# EAGLE design smartstand-usb-dac-i2s-rev-b (EAGLE 7.3.0)

## Sheet 1 of 5
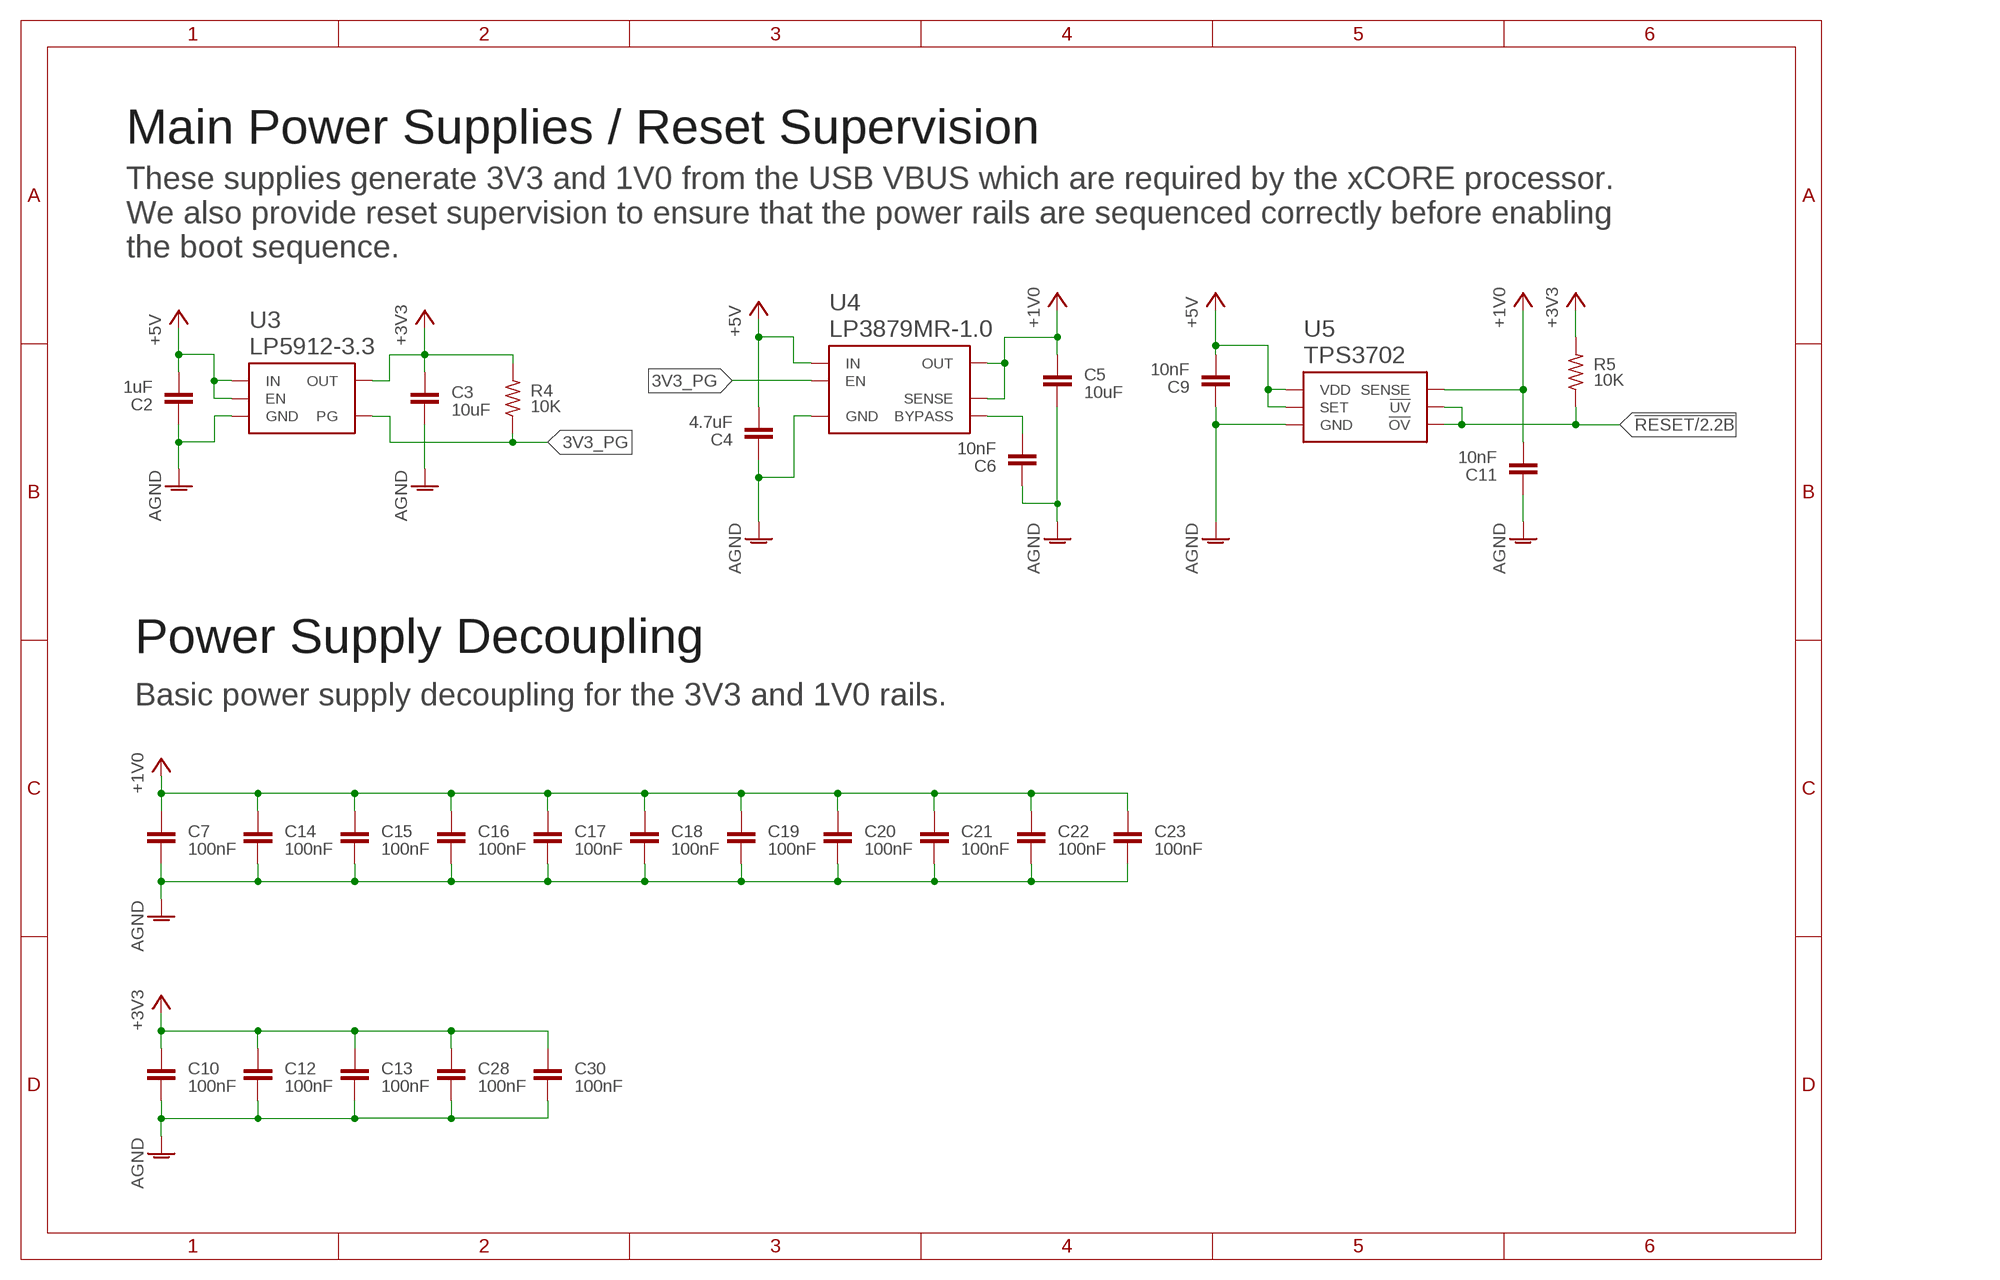
[diagram p0: schematic, sheet 1]

### Parts
C2  1uF  C-EUC0603  [C0603]
C3  10uF  C-EUC0603  [C0603]
C4  4.7uF  C-EUC0603  [C0603]
C5  10uF  C-EUC0603  [C0603]
C6  10nF  C-EUC0402  [C0402]
C7  100nF  C-EUC0402  [C0402]
C9  10nF  C-EUC0402  [C0402]
C10  100nF  C-EUC0402  [C0402]
C11  10nF  C-EUC0402  [C0402]
C12  100nF  C-EUC0402  [C0402]
C13  100nF  C-EUC0402  [C0402]
C14  100nF  C-EUC0402  [C0402]
C15  100nF  C-EUC0402  [C0402]
C16  100nF  C-EUC0402  [C0402]
C17  100nF  C-EUC0402  [C0402]
C18  100nF  C-EUC0402  [C0402]
C19  100nF  C-EUC0402  [C0402]
C20  100nF  C-EUC0402  [C0402]
C21  100nF  C-EUC0402  [C0402]
C22  100nF  C-EUC0402  [C0402]
C23  100nF  C-EUC0402  [C0402]
C28  100nF  C-EUC0402  [C0402]
C30  100nF  C-EUC0402  [C0402]
R4  10K  R-US-VERTICALR0402  [R0402]
R5  10K  R-US-VERTICALR0402  [R0402]
U3  LP5912-3.3  LP5912-3.3DRV  [P-PWSON-N6]
U4  LP3879MR-1.0  [PSOP-8-POWERPAD-DDA]
U5  TPS3702  TPS3702CX10DDC  [R-PDSO-G6]

### Nets
3V3_PG: R4.1 U3.P$3(PG) U4.8(EN)
!RESET: R5.1 U5.1(!UV) U5.6(!OV) ; also sheet 2,5
+1V0: C5.1 C7.1 C11.2 C14.1 C15.1 C16.1 C17.1 C18.1 C19.1 C20.1 C21.1 C22.1 C23.1 U4.5(OUT) U4.6(SENSE) U5.3(SENSE) ; also sheet 2,5
+3V3: C3.1 C10.1 C12.1 C13.1 C28.1 C30.1 R4.2 R5.2 U3.P$1(OUT) ; also sheet 2,3,4,5
+5V: C2.2 C4.2 C9.2 U3.P$4(EN) U3.P$6(IN) U4.4(IN) U5.4(SET) U5.5(VDD) ; also sheet 3,4,5
AGND: C2.1 C3.2 C4.1 C5.2 C6.1 C7.2 C9.1 C10.2 C11.1 C12.2 C13.2 C14.2 C15.2 C16.2 C17.2 C18.2 C19.2 C20.2 C21.2 C22.2 C23.2 C28.2 C30.2 U3.P$5(GND) U3.P$8(GND) U3.P$9(GND) U3.P$EP(GND) U4.3(GND) U4.EP(GND) U4.P$1(GND) U4.P$2(GND) U4.P$3(GND) U4.P$4(GND) U4.P$5(GND) U4.P$6(GND) U5.2(GND) ; also sheet 2,3,4,5
N$11: C6.2 U4.1(BYPASS)

### Notes on the sheet
- Main Power Supplies / Reset Supervision
- These supplies generate 3V3 and 1V0 from the USB VBUS which are required by the xCORE processor.
  We also provide reset supervision to ensure that the power rails are sequenced correctly before enabling
  the boot sequence.
- Power Supply Decoupling
- Basic power supply decoupling for the 3V3 and 1V0 rails.

## Sheet 2 of 5
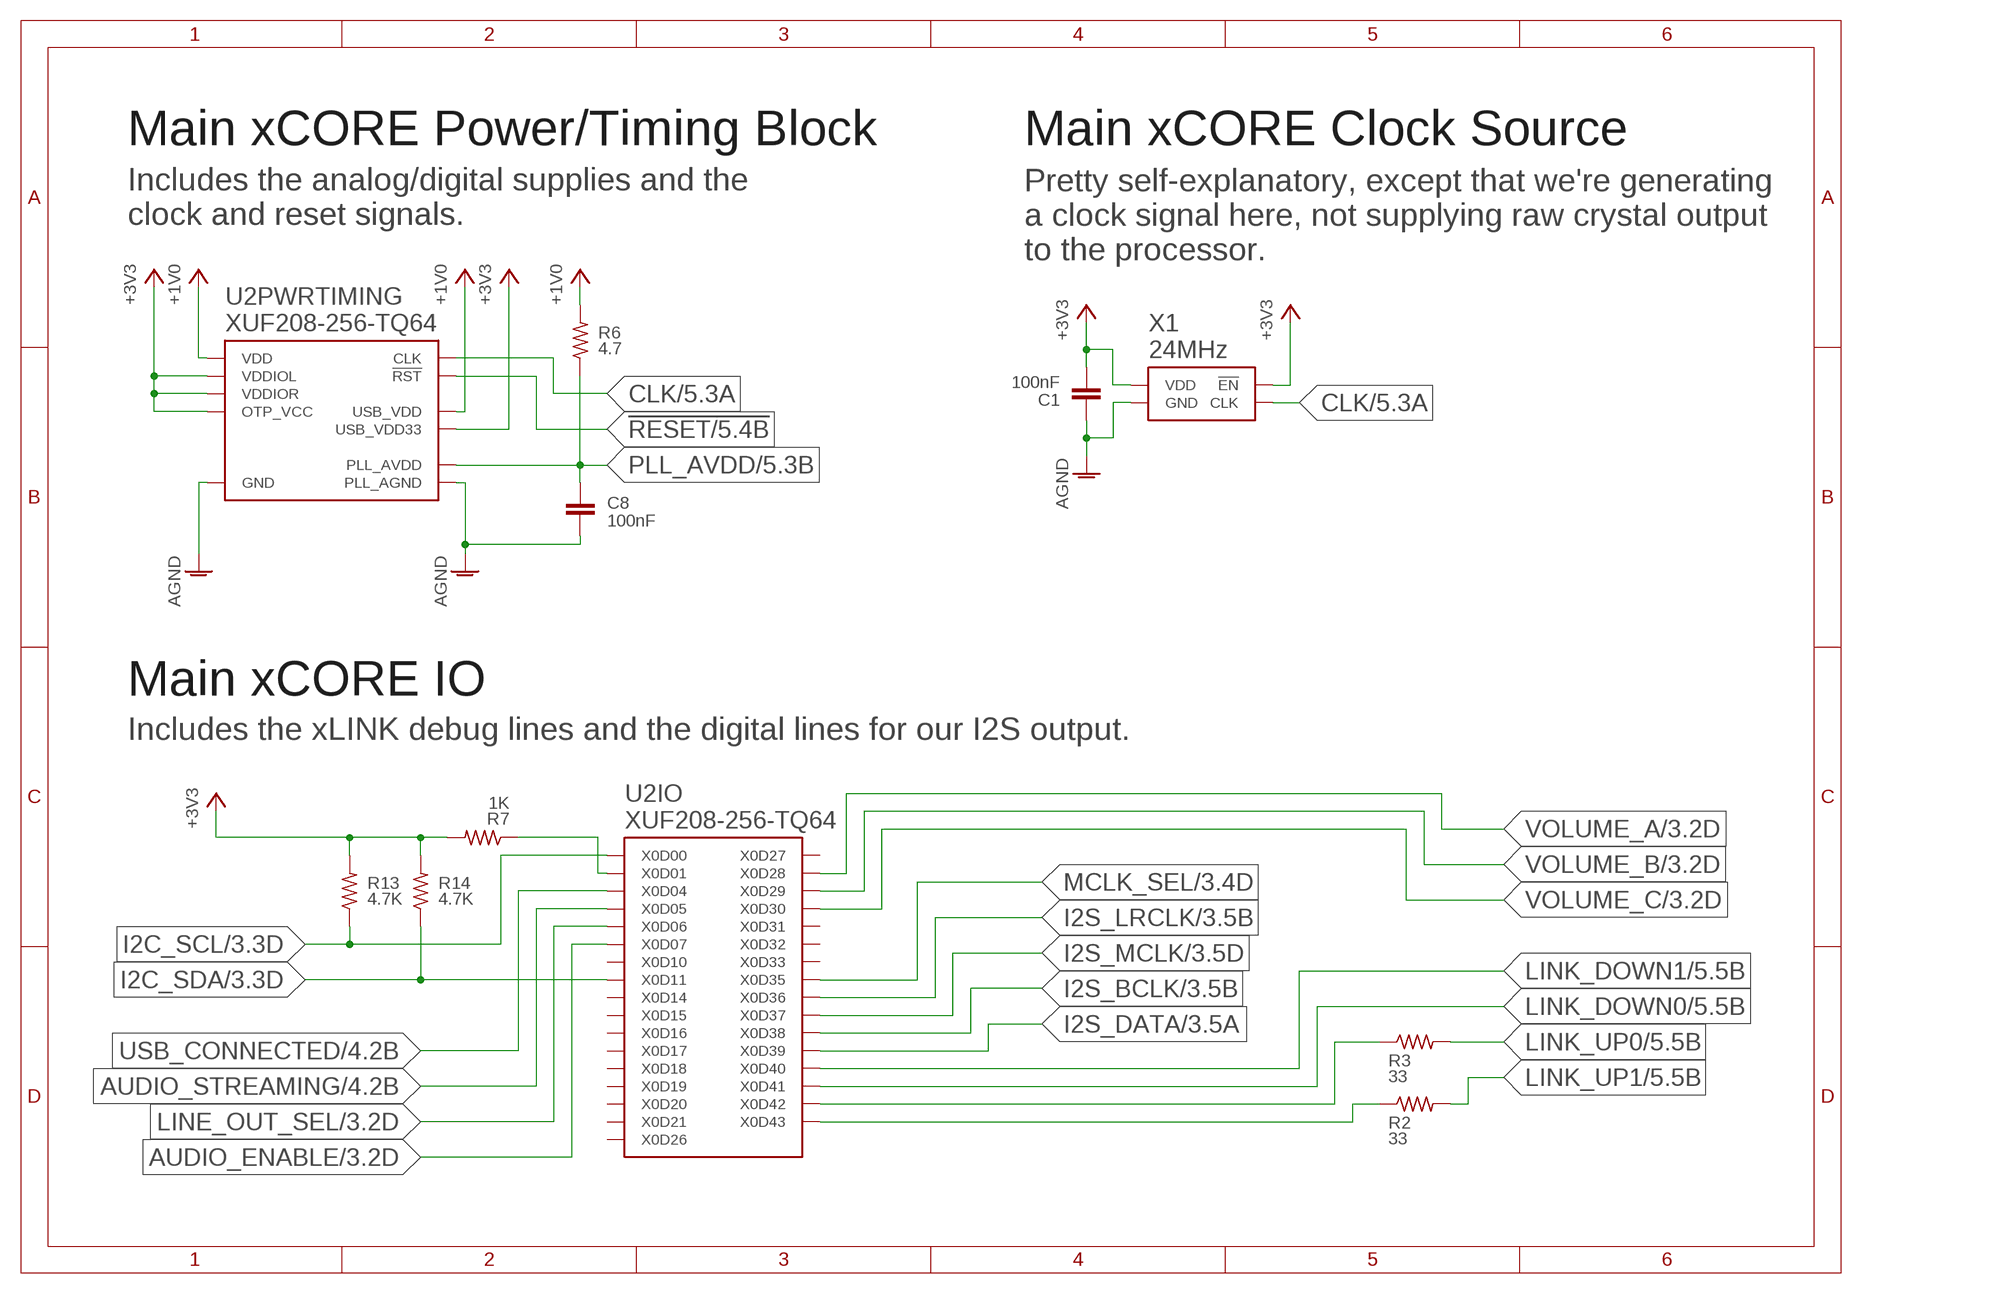
[diagram p1: schematic, sheet 2]

### Parts
C1  100nF  C-EUC0402  [C0402]
C8  100nF  C-EUC0402  [C0402]
R2  33  R-US_R0402  [R0402]
R3  33  R-US_R0402  [R0402]
R6  4.7  R-US-VERTICALR0402  [R0402]
R7  1K  R-US_R0402  [R0402]
R13  4.7K  R-US-VERTICALR0402  [R0402]
R14  4.7K  R-US-VERTICALR0402  [R0402]
U2  XUF208-256-TQ64  [TQFP-64-EXPOSED-PAD]
X1  24MHz  KC2520C  [KC2520C]

### Nets
!RESET: U2.P$57(PWRTIMING:!RST) ; also sheet 1,5
+1V0: R6.2 U2.P$9(PWRTIMING:VDD) U2.P$10(PWRTIMING:VDD) U2.P$20(PWRTIMING:VDD) U2.P$27(PWRTIMING:USB_VDD) U2.P$31(PWRTIMING:VDD) U2.P$39(PWRTIMING:VDD) U2.P$40(PWRTIMING:VDD) U2.P$41(PWRTIMING:VDD) U2.P$52(PWRTIMING:VDD) U2.P$56(PWRTIMING:VDD) U2.P$59(PWRTIMING:VDD) ; also sheet 1,5
+3V3: C1.2 R7.2 R13.2 R14.2 U2.P$3(PWRTIMING:VDDIOL) U2.P$13(PWRTIMING:VDDIOL) U2.P$22(PWRTIMING:USB_VDD33) U2.P$34(PWRTIMING:VDDIOR) U2.P$44(PWRTIMING:VDDIOR) U2.P$55(PWRTIMING:OTP_VCC) X1.P$1(!EN) X1.P$4(VDD) ; also sheet 1,3,4,5
AGND: C1.1 C8.2 U2.P$54(PWRTIMING:PLL_AGND) U2.P$65(PWRTIMING:GND) U2.P$66(PWRTIMING:GND) U2.P$67(PWRTIMING:GND) U2.P$68(PWRTIMING:GND) U2.P$69(PWRTIMING:GND) U2.P$70(PWRTIMING:GND) U2.P$71(PWRTIMING:GND) U2.P$72(PWRTIMING:GND) U2.P$73(PWRTIMING:GND) U2.P$74(PWRTIMING:GND) X1.P$2(GND) ; also sheet 1,3,4,5
AUDIO_ENABLE: U2.P$19(IO:X0D07) ; also sheet 3
AUDIO_STREAMING: U2.P$17(IO:X0D05) ; also sheet 4
CLK: U2.P$58(PWRTIMING:CLK) X1.P$3(CLK) ; also sheet 5
I2C_SCL: R13.1 U2.P$14(IO:X0D00) ; also sheet 3
I2C_SDA: R14.1 U2.P$16(IO:X0D11) ; also sheet 3
I2S_BCLK: U2.P$2(IO:X0D38) ; also sheet 3
I2S_DATA: U2.P$4(IO:X0D39) ; also sheet 3
I2S_LRCLK: U2.P$1(IO:X0D36) ; also sheet 3
I2S_MCLK: U2.P$64(IO:X0D37) ; also sheet 3
LINE_OUT_SEL: U2.P$18(IO:X0D06) ; also sheet 3,4
LINK_DOWN0: U2.P$6(IO:X0D41) ; also sheet 5
LINK_DOWN1: U2.P$5(IO:X0D40) ; also sheet 5
LINK_UP0: R3.2 ; also sheet 5
LINK_UP1: R2.2 ; also sheet 5
MCLK_SEL: U2.P$42(IO:X0D35) ; also sheet 3
N$8: R3.1 U2.P$7(IO:X0D42)
N$9: R2.1 U2.P$8(IO:X0D43)
N$10: R7.1 U2.P$11(IO:X0D01)
PLL_AVDD: C8.1 R6.1 U2.P$53(PWRTIMING:PLL_AVDD) ; also sheet 5
USB_CONNECTED: U2.P$15(IO:X0D04) ; also sheet 4
VOLUME_A: U2.P$47(IO:X0D28) ; also sheet 3
VOLUME_B: U2.P$49(IO:X0D29) ; also sheet 3
VOLUME_C: U2.P$50(IO:X0D30) ; also sheet 3
Unconnected: U2.P$12(IO:X0D10) U2.P$28(IO:X0D14) U2.P$29(IO:X0D15) U2.P$30(IO:X0D20) U2.P$32(IO:X0D21) U2.P$35(IO:X0D16) U2.P$36(IO:X0D17) U2.P$37(IO:X0D18) U2.P$38(IO:X0D19) U2.P$43(IO:X0D26) U2.P$45(IO:X0D27) U2.P$46(IO:X0D32) U2.P$48(IO:X0D33) U2.P$51(IO:X0D31)

### Notes on the sheet
- Main xCORE Power/Timing Block | Main xCORE Clock Source
- Includes the analog/digital supplies and the
  clock and reset signals.
- Pretty self-explanatory, except that we're generating
  a clock signal here, not supplying raw crystal output
  to the processor.
- Main xCORE IO
- Includes the xLINK debug lines and the digital lines for our I2S output.

## Sheet 3 of 5
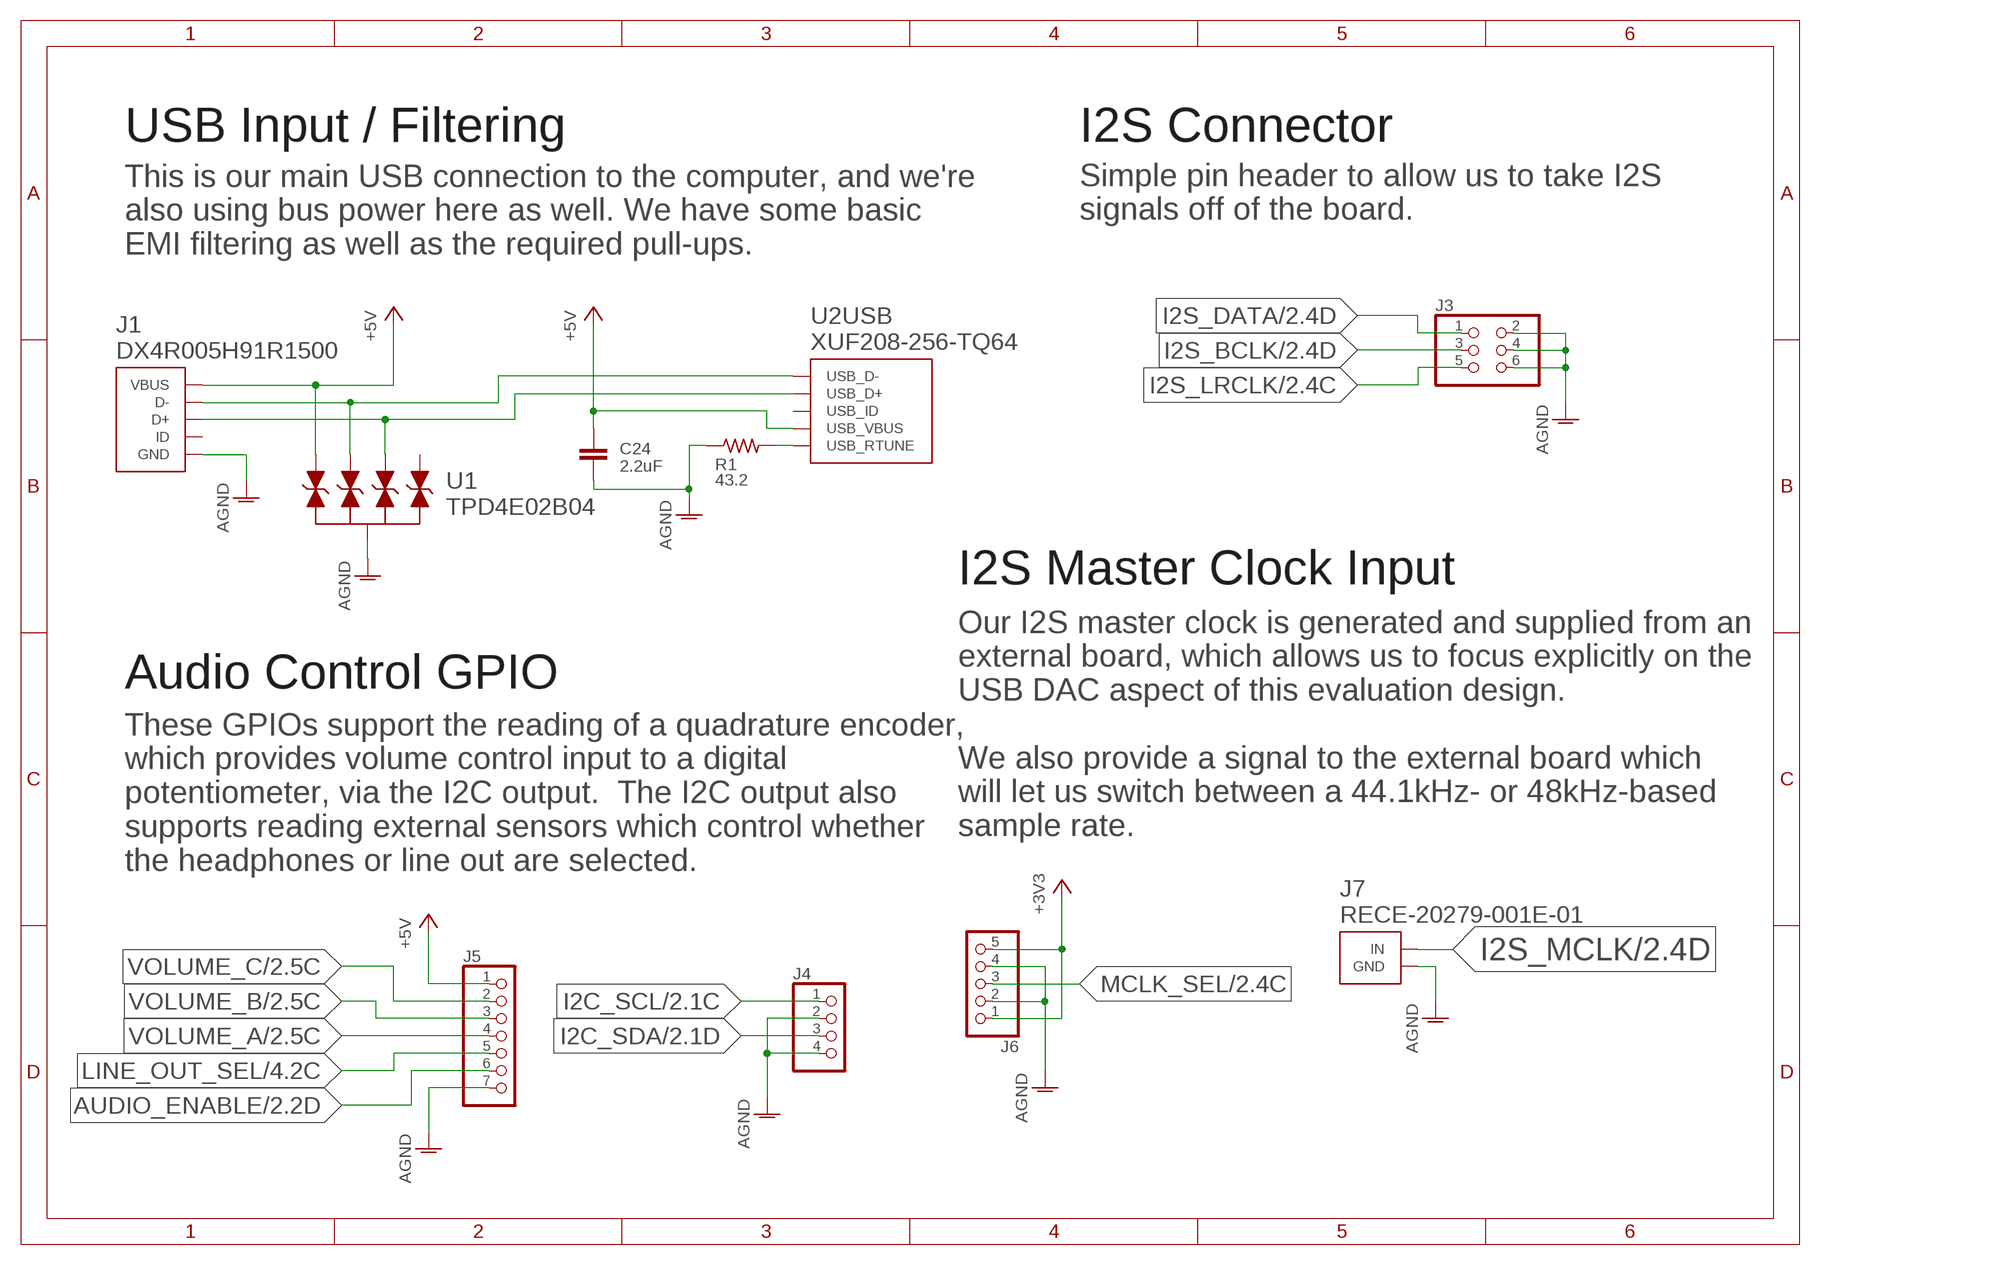
[diagram p2: schematic, sheet 3]

### Parts
C24  2.2uF  C-EUC0603  [C0603]
J1  DX4R005H91R1500  [DX4R005H91R1500]
J3  PINHD-2X3  [2X03]
J4  PINHD-1X4  [1X04]
J5  PINHD-1X7  [1X07]
J6  PINHD-1X5  [1X05]
J7  RECE-20279-001E-01  [IPEX-MHF]
R1  43.2  R-US_R0402  [R0402]
U1  TPD4E02B04  [R-PUSON-N10]

### Nets
+3V3: J6.1 J6.5 ; also sheet 1,2,4,5
+5V: C24.1 J1.P$1(VBUS) J5.1 U1.P$1(IO1) U1.P$10(IO1) U2.P$23(USB:USB_VBUS) ; also sheet 1,4,5
AGND: C24.2 J1.P$5(GND) J3.2 J3.4 J3.6 J4.2 J4.4 J5.7 J6.2 J6.4 J7.P$1(GND) J7.P$2(GND) R1.1 U1.P$3(GND) U1.P$8(GND) ; also sheet 1,2,4,5
AUDIO_ENABLE: J5.6 ; also sheet 2
I2C_SCL: J4.1 ; also sheet 2
I2C_SDA: J4.3 ; also sheet 2
I2S_BCLK: J3.3 ; also sheet 2
I2S_DATA: J3.1 ; also sheet 2
I2S_LRCLK: J3.5 ; also sheet 2
I2S_MCLK: J7.P$3(IN) ; also sheet 2
LINE_OUT_SEL: J5.5 ; also sheet 2,4
MCLK_SEL: J6.3 ; also sheet 2
N$1: R1.2 U2.P$24(USB:USB_RTUNE)
USB_D_N [USB]: J1.P$2(D-) U1.P$2(IO2) U1.P$9(IO2) U2.P$26(USB:USB_D-)
USB_D_P [USB]: J1.P$3(D+) U1.P$4(IO3) U1.P$7(IO3) U2.P$25(USB:USB_D+)
VOLUME_A: J5.4 ; also sheet 2
VOLUME_B: J5.3 ; also sheet 2
VOLUME_C: J5.2 ; also sheet 2
Unconnected: J1.P$4(ID) U1.P$5(IO4) U1.P$6(IO4) U2.P$21(USB:USB_ID)

### Notes on the sheet
- USB Input / Filtering | I2S Connector
- Simple pin header to allow us to take I2S
  signals off of the board.
- This is our main USB connection to the computer, and we're
  also using bus power here as well. We have some basic
  EMI filtering as well as the required pull-ups.
- I2S Master Clock Input
- Audio Control GPIO
- Our I2S master clock is generated and supplied from an
  external board, which allows us to focus explicitly on the
  USB DAC aspect of this evaluation design.
  
  We also provide a signal to the external board which
  will let us switch between a 44.1kHz- or 48kHz-based
  sample rate.
- These GPIOs support the reading of a quadrature encoder,
  which provides volume control input to a digital
  potentiometer, via the I2C output.  The I2C output also
  supports reading external sensors which control whether
  the headphones or line out are selected.

## Sheet 4 of 5
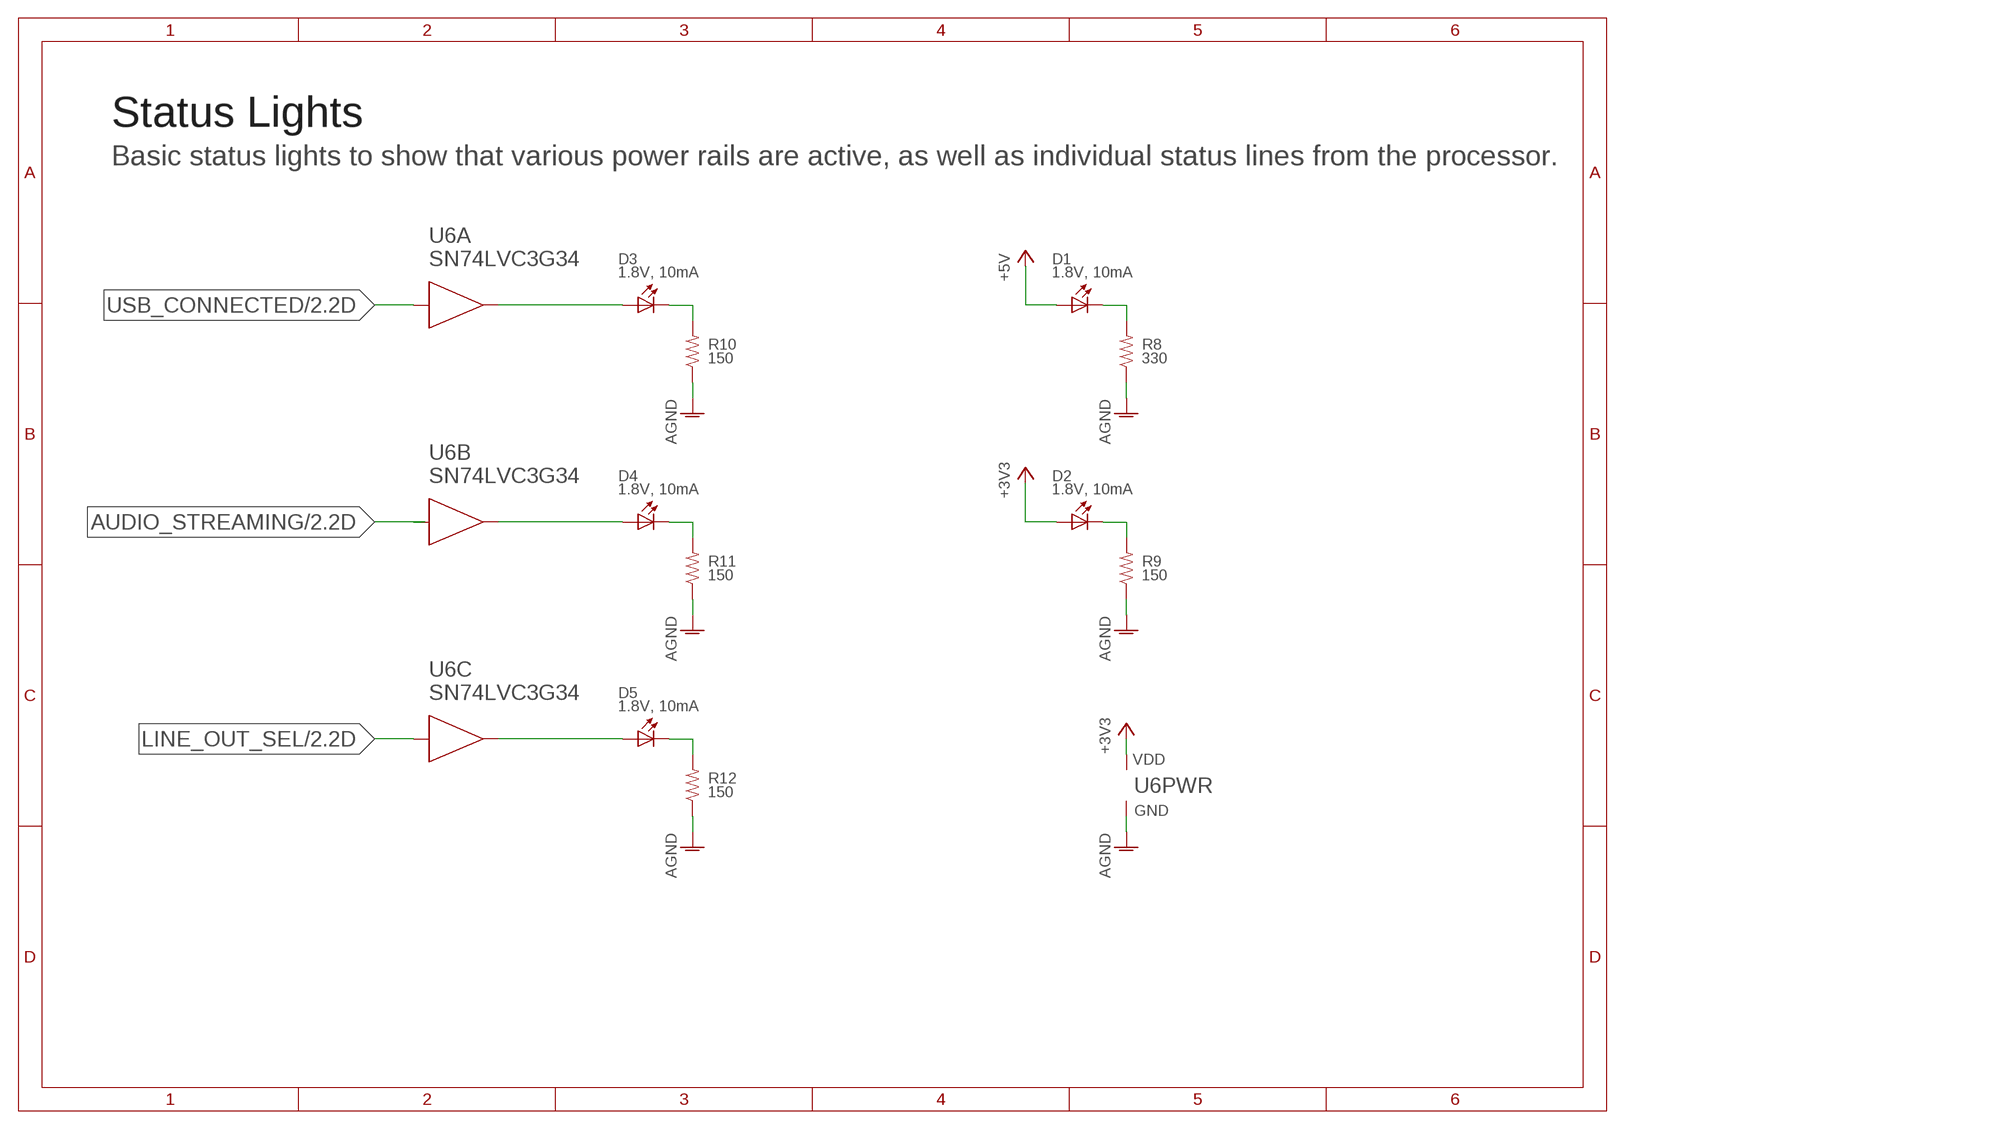
[diagram p3: schematic, sheet 4]

### Parts
D1  1.8V, 10mA  DIALIGHT-598-MICROSMD-0603  [DIALIGHT-0603]
D2  1.8V, 10mA  DIALIGHT-598-MICROSMD-0603  [DIALIGHT-0603]
D3  1.8V, 10mA  DIALIGHT-598-MICROSMD-0603  [DIALIGHT-0603]
D4  1.8V, 10mA  DIALIGHT-598-MICROSMD-0603  [DIALIGHT-0603]
D5  1.8V, 10mA  DIALIGHT-598-MICROSMD-0603  [DIALIGHT-0603]
R8  330  R-US-VERTICALR0402  [R0402]
R9  150  R-US-VERTICALR0402  [R0402]
R10  150  R-US-VERTICALR0402  [R0402]
R11  150  R-US-VERTICALR0402  [R0402]
R12  150  R-US-VERTICALR0402  [R0402]
U6  SN74LVC3G34  [R-PDSO-G8]

### Nets
+3V3: D2.1(A) U6.8(PWR:VDD) ; also sheet 1,2,3,5
+5V: D1.1(A) ; also sheet 1,3,5
AGND: R8.1 R9.1 R10.1 R11.1 R12.1 U6.4(PWR:GND) ; also sheet 1,2,3,5
AUDIO_STREAMING: U6.3(B:A) ; also sheet 2
LINE_OUT_SEL: U6.6(C:A) ; also sheet 2,3
N$6: D4.1(A) U6.5(B:Y)
N$7: D1.2(C) R8.2
N$12: D2.2(C) R9.2
N$13: D3.1(A) U6.7(A:Y)
N$14: D3.2(C) R10.2
N$15: D4.2(C) R11.2
N$16: D5.1(A) U6.2(C:Y)
N$17: D5.2(C) R12.2
USB_CONNECTED: U6.1(A:A) ; also sheet 2

### Notes on the sheet
- Status Lights
- Basic status lights to show that various power rails are active, as well as individual status lines from the processor.

## Sheet 5 of 5
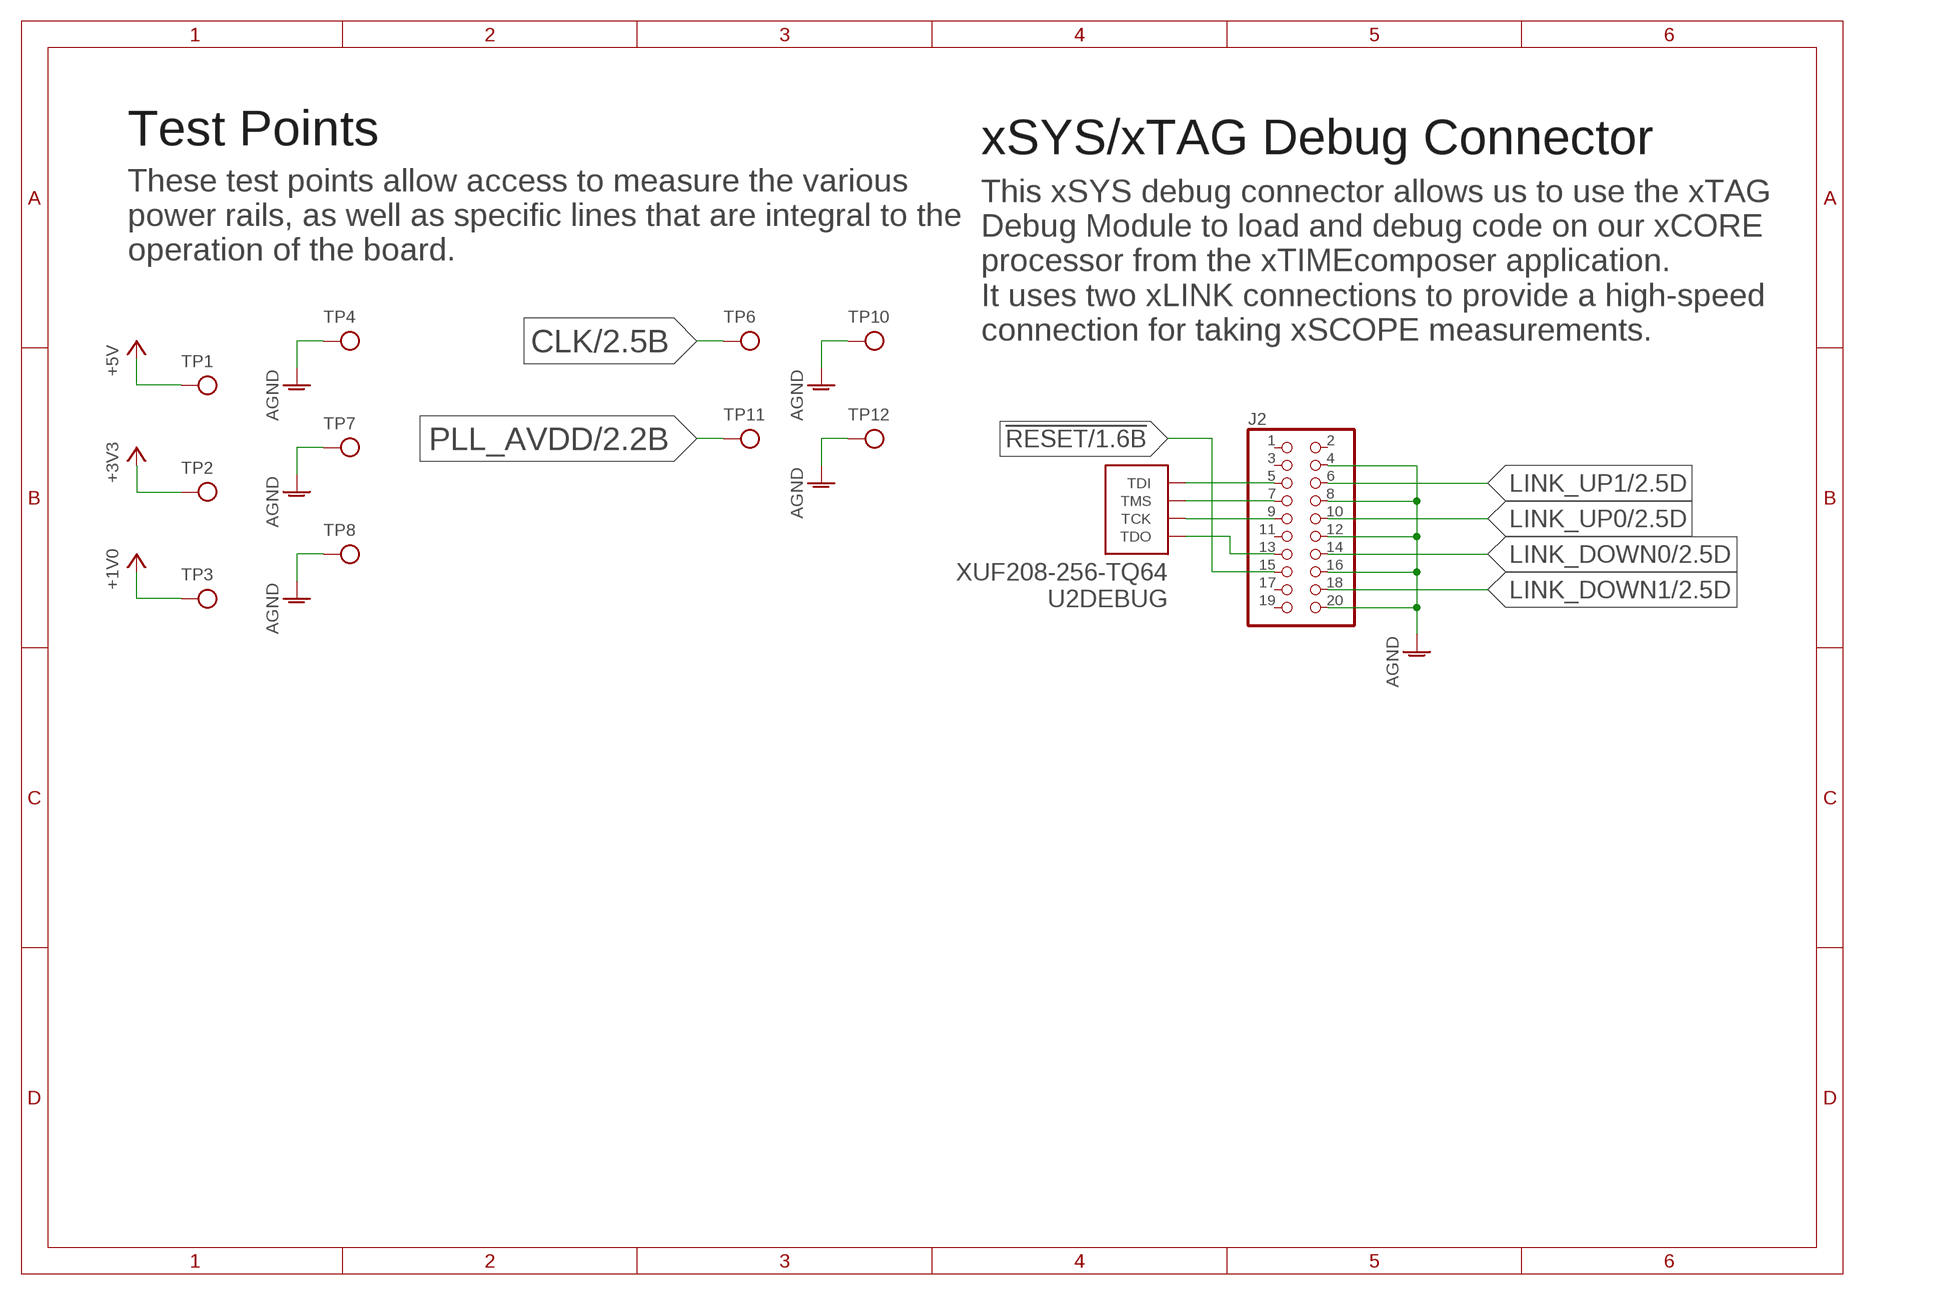
[diagram p4: schematic, sheet 5]

### Parts
J2  PINHD-2X10  [2X10]
TP1  TESTPOINT-1.5MM  [TESTPOINT-1.5]
TP2  TESTPOINT-1.5MM  [TESTPOINT-1.5]
TP3  TESTPOINT-1.5MM  [TESTPOINT-1.5]
TP4  TESTPOINT-1.5MM-SQUARE  [TESTPOINT-1.5-SQUARE]
TP6  TESTPOINT-1.5MM  [TESTPOINT-1.5]
TP7  TESTPOINT-1.5MM-SQUARE  [TESTPOINT-1.5-SQUARE]
TP8  TESTPOINT-1.5MM-SQUARE  [TESTPOINT-1.5-SQUARE]
TP10  TESTPOINT-1.5MM-SQUARE  [TESTPOINT-1.5-SQUARE]
TP11  TESTPOINT-1.5MM  [TESTPOINT-1.5]
TP12  TESTPOINT-1.5MM-SQUARE  [TESTPOINT-1.5-SQUARE]

### Nets
!RESET: J2.15 ; also sheet 1,2
+1V0: TP3.P$1 ; also sheet 1,2
+3V3: TP2.P$1 ; also sheet 1,2,3,4
+5V: TP1.P$1 ; also sheet 1,3,4
AGND: J2.4 J2.8 J2.12 J2.16 J2.20 TP4.P$1 TP7.P$1 TP8.P$1 TP10.P$1 TP12.P$1 ; also sheet 1,2,3,4
CLK: TP6.P$1 ; also sheet 2
LINK_DOWN0: J2.14 ; also sheet 2
LINK_DOWN1: J2.18 ; also sheet 2
LINK_UP0: J2.10 ; also sheet 2
LINK_UP1: J2.6 ; also sheet 2
N$2: J2.7 U2.P$60(DEBUG:TMS)
N$3: J2.9 U2.P$61(DEBUG:TCK)
N$4: J2.5 U2.P$62(DEBUG:TDI)
N$5: J2.13 U2.P$63(DEBUG:TDO)
PLL_AVDD: TP11.P$1 ; also sheet 2
Unconnected: J2.1 J2.2 J2.3 J2.11 J2.17 J2.19

### Notes on the sheet
- Test Points | xSYS/xTAG Debug Connector
- These test points allow access to measure the various
  power rails, as well as specific lines that are integral to the
  operation of the board.
- This xSYS debug connector allows us to use the xTAG
  Debug Module to load and debug code on our xCORE
  processor from the xTIMEcomposer application.
  It uses two xLINK connections to provide a high-speed
  connection for taking xSCOPE measurements.

## Library data of the parts
C1 C7 C8 C10 C12-C23 C28 C30 = passives:C-EU: CAPACITOR, European symbol; PN: GRM155R71C104KA88D
C2 = passives:C-EU: CAPACITOR, European symbol; PN: GRM188R61C105KA93D
C3 C5 = passives:C-EU: CAPACITOR, European symbol; PN: GRM188R60J106ME47D
C4 = passives:C-EU: CAPACITOR, European symbol; PN: GRM188R61A475KE15D
C6 C9 C11 = passives:C-EU: CAPACITOR, European symbol; PN: GRM15XR71C103KA86D
C24 = passives:C-EU: CAPACITOR, European symbol; PN: GRM188R61C225KE15D
D1-D5 = dialight:DIALIGHT-598-MICROSMD; PN: 598-8070-107F
J1 = jae:DX4R005H91R1500; PN: DX4R005H91R1500
J2 = pin-headers:PINHD-2X10: PIN HEADER; PN: N2520-5002RB
J3 = pin-headers:PINHD-2X3: PIN HEADER
J4 = pin-headers:PINHD-1X4: PIN HEADER
J5 = pin-headers:PINHD-1X7: PIN HEADER
J6 = pin-headers:PINHD-1X5: PIN HEADER; PN: 90120-0125
J7 = taoglas:RECE-20279-001E-01; PN: RECE-20279-001E-01
R1 = passives:R-US_: RESISTOR, American symbol; PN: RK73B1ETTP430J
R2 R3 = passives:R-US_: RESISTOR, American symbol; PN: RK73B1ETTP330J
R4 R5 = passives:R-US-VERTICAL; PN: RK73B1ETTP103J
R6 = passives:R-US-VERTICAL; PN: SG73P1ETTP4R7J
R7 = passives:R-US_: RESISTOR, American symbol; PN: RK73B1ETTP102J
R8 = passives:R-US-VERTICAL; PN: ERJ-PA2J331X
R9-R12 = passives:R-US-VERTICAL; PN: SG73P1ETTP151J
R13 R14 = passives:R-US-VERTICAL
TP1-TP4 TP6-TP8 TP10-TP12 = test:TESTPOINT: Simple exposed copper testpoint pad.
U1 = texas-instruments:TPD4E02B04: 4-Channel ESD Protection Diode for USB Type-C and HDMI 2.0
U2 = xmos:XUF208-256-TQ64: Multicore Microcontroller with Advanced Multi-Core RISC Architecture https://www.xmos.com/download/private/XUF208-256-TQ64-Datasheet%281.10%29.pdf; PN: XUF208-256-TQ64-C10
U3 = texas-instruments:LP5912: 500-mA Low-Noise, Low-IQ LDO; PN: LP5912-3.3DRVR
U4 = texas-instruments:LP3879: LP3879 - Micropower 800mA Low Noise "Ceramic Stable" Voltage Regulator for Low Voltage Applications The LP3879 is a 800 mA fixed-output voltage regulator designed to provide high performance and low noise in applications requiring output voltages between 1.0V and 1.2V. Using an optimized VIP (Vertically Integrated PNP) process, the LP3879 delivers superior performance: Ground Pin Current: Typically 5.5 mA @ 800 mA load, and 200 µA @ 100 µA load. Low Power Shutdown: The LP3879 draws less than 10 μA quiescent current when shutdown pin is pulled low. Precision Output: Ensured output voltage accuracy is 1% at room temperature. Low Noise: Broadband output noise is only 18 μV (typical) with 10 nF bypass capacitor.; PN: LP3879MR-1.0/NOPB
U5 = texas-instruments:TPS3702: High-Accuracy, Overvoltage and Undervoltage Monitor; PN: TPS3702CX10DDC
U6 = texas-instruments:SN74LVC3G34: Triple Buffer Gate
X1 = crystals:KC2520C: High Stability Clock Oscillators, CMOS, 2.5V/3.3V Compatible, 2.5×2.0mm; PN: KC2520C24.0000C2LE00

## Net classes
0 default: width 0.152 mm, drill 0.254 mm
1 USB: width 0.279 mm, drill 0.254 mm

## Board
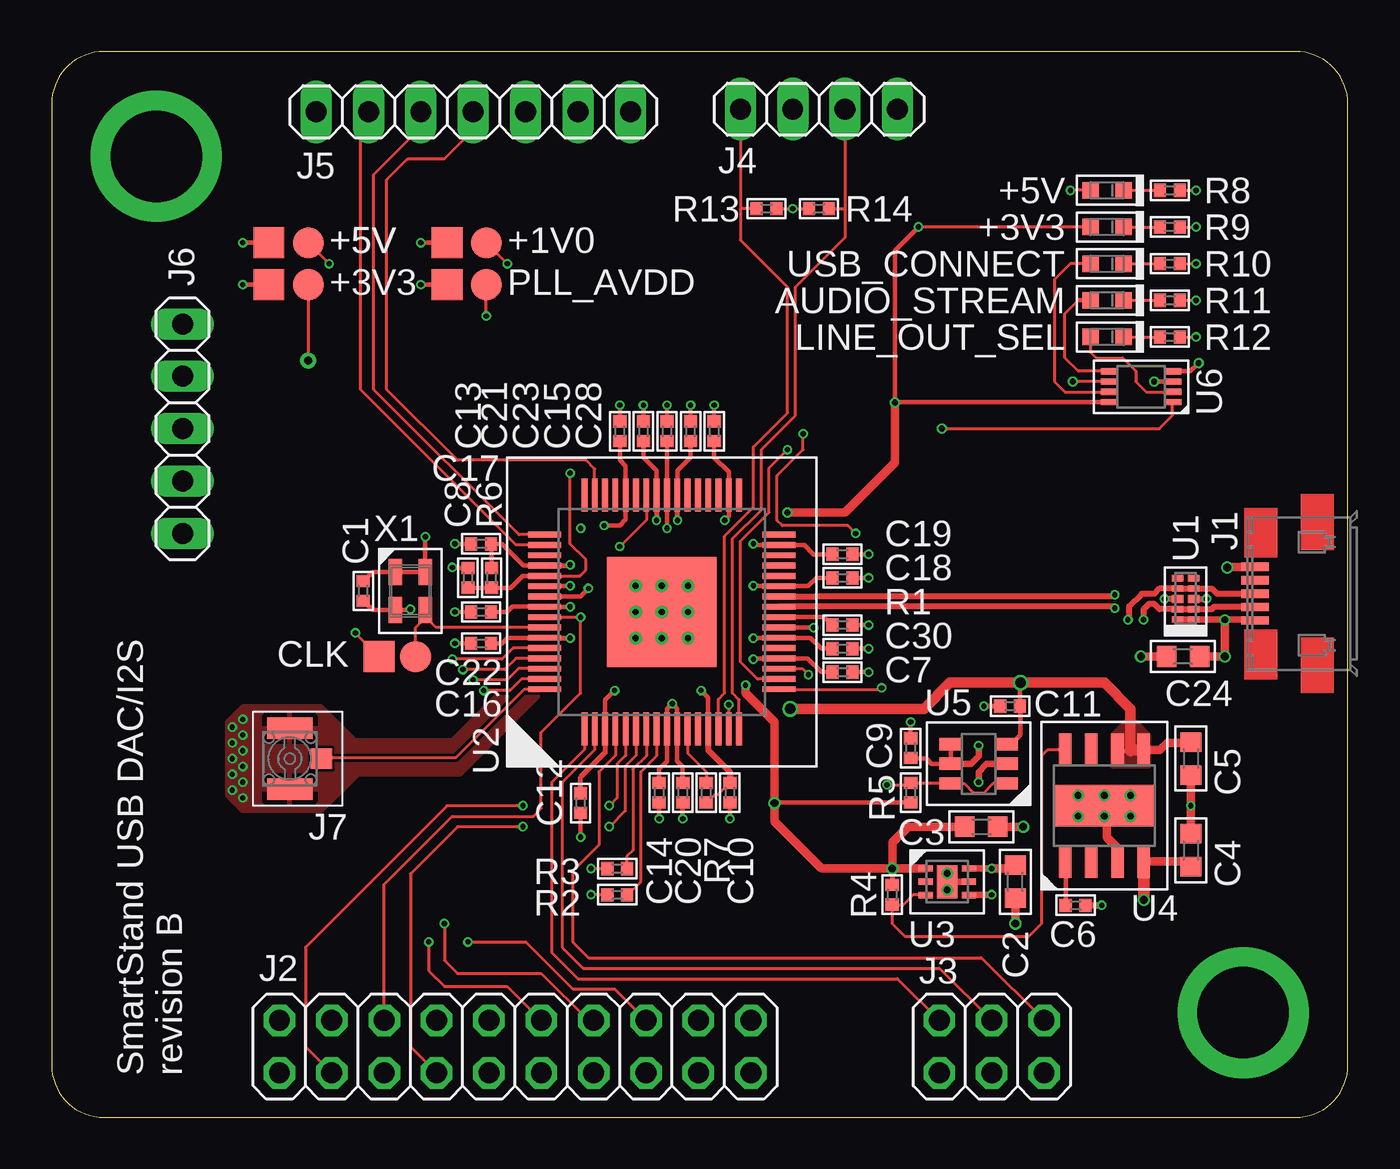
[diagram p5: board, top side]
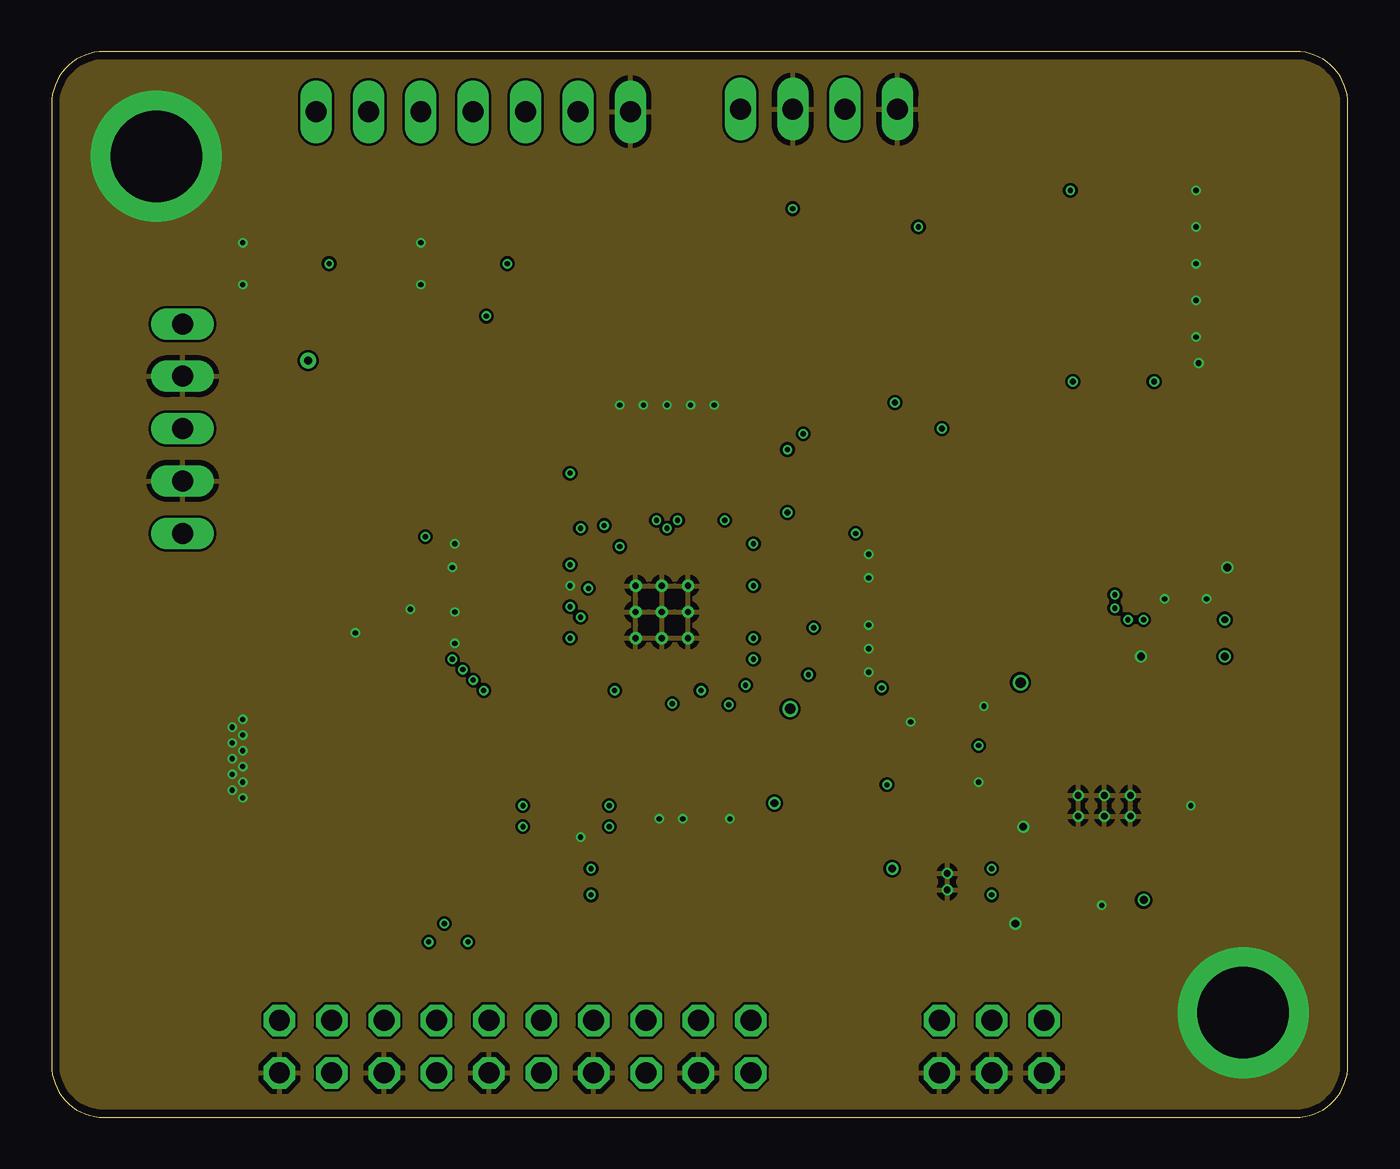
[diagram p6: board, inner layer Route2]
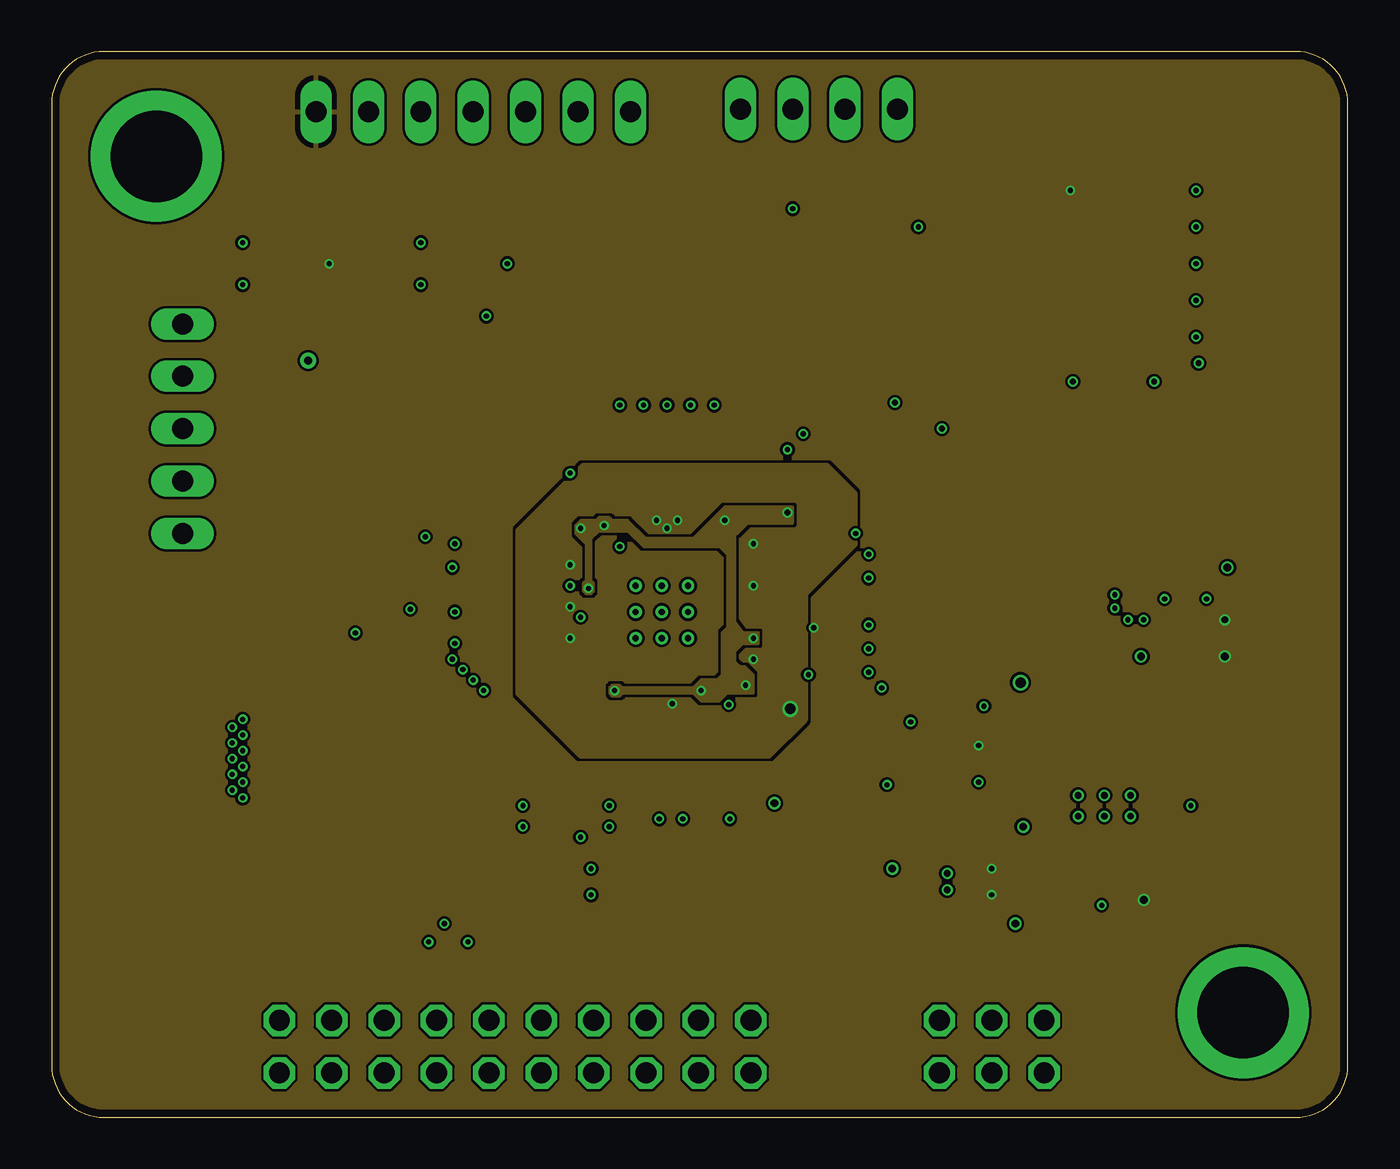
[diagram p7: board, inner layer Route15]
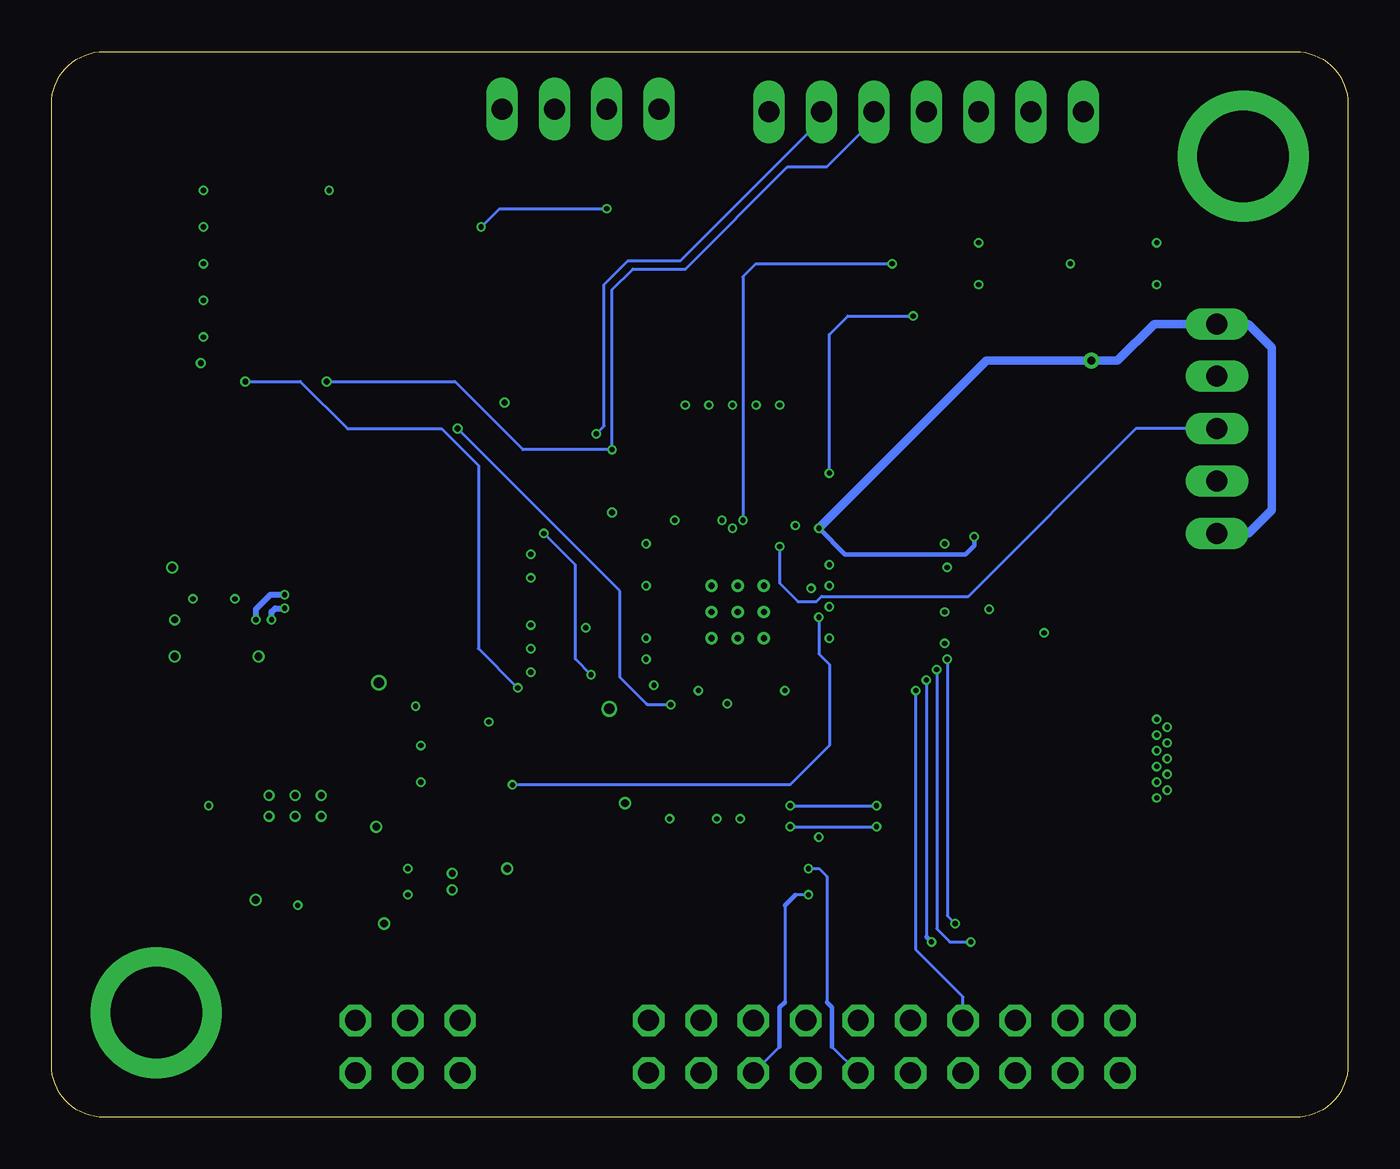
[diagram p8: board, bottom side, seen from below]

Size 62.87 x 51.69 mm. Coordinates in mm from the lower left corner, seen from the top.
Outline: 0,49.15 0,2.54 arc90 2.54,0 60.33,0 arc90 62.87,2.54 62.87,49.15 arc90 60.33,51.69 2.54,51.69 arc90 0,49.15
Copper layers (1*2*15*16): Top 0.035559375mm / dielectric 0.17018125mm / Route2 0.01778125mm / dielectric 47mil / Route15 0.01778125mm / dielectric 0.17018125mm / Bottom 0.035559375mm
Design rules "OSHPark-4layer": minimum track width 5mil, minimum drill 10mil, track to track 5mil, track to pad 5mil, pad to pad 5mil, via to via 5mil, smd to smd 5mil, copper to edge 15mil, drill to drill 6mil, minimum pad ring 4mil, minimum via ring 4mil, stop-mask expansion 2.5mil, vias tented up to drill 11mil, thermal gap 10mil

### Footprints (pad centres in the part's own frame; a part is rotated, then mirrored left to right if it is on the bottom)
C0402 = smd 0.59 x 0.64: 1 -0.48,0; 2 0.48,0
C0603 = smd 0.95 x 1: 1 -0.8,0; 2 0.8,0
DIALIGHT-0603 = smd 0.8 x 0.8: 1 -0.8,0; 2 0.8,0
DX4R005H91R1500 = smd 0.4 x 1.35: P$1 -1.3,4.125; P$2 -0.65,4.125; P$3 0,4.125; P$4 0.65,4.125; P$5 1.3,4.125
2X10 = drill 1.016 octagon: 1 -11.43,-1.27; 2 -11.43,1.27; 3 -8.89,-1.27; 4 -8.89,1.27; 5 -6.35,-1.27; 6 -6.35,1.27; 7 -3.81,-1.27; 8 -3.81,1.27; 9 -1.27,-1.27; 10 -1.27,1.27; 11 1.27,-1.27; 12 1.27,1.27; 13 3.81,-1.27; 14 3.81,1.27; 15 6.35,-1.27; 16 6.35,1.27; 17 8.89,-1.27; 18 8.89,1.27; 19 11.43,-1.27; 20 11.43,1.27
2X03 = drill 1.016 octagon: 1 -2.54,-1.27; 2 -2.54,1.27; 3 0,-1.27; 4 0,1.27; 5 2.54,-1.27; 6 2.54,1.27
1X04 = drill 1.016 long: 1 -3.81,0; 2 -1.27,0; 3 1.27,0; 4 3.81,0
1X07 = drill 1.016 long: 1 -7.62,0; 2 -5.08,0; 3 -2.54,0; 4 0,0; 5 2.54,0; 6 5.08,0; 7 7.62,0
1X05 = drill 1.016 long: 1 -5.08,0; 2 -2.54,0; 3 0,0; 4 2.54,0; 5 5.08,0
IPEX-MHF = smd 2.2 x 1.05: P$1 0,1.475; P$2 0,-1.475 | smd 1.05 x 1: P$3 1.525,0
R0402 = smd 0.59 x 0.64: 1 -0.48,0; 2 0.48,0
TESTPOINT-1.5 = smd 1.5 x 1.5: P$1 0,0
TESTPOINT-1.5-SQUARE = smd 1.5 x 1.5: P$1 0,0
R-PUSON-N10 = smd 0.3 x 0.55: P$1 -1,-0.385; P$2 -0.5,-0.385; P$4 0.5,-0.385; P$5 1,-0.385; P$6 1,0.385; P$7 0.5,0.385; P$9 -0.5,0.385; P$10 -1,0.385 | smd 0.4 x 0.55: P$3 0,-0.385; P$8 0,0.385
TQFP-64-EXPOSED-PAD = smd 0.28 x 1.6: P$1 -3.75,-5.68; P$2 -3.25,-5.68; P$3 -2.75,-5.68; P$4 -2.25,-5.68; P$5 -1.75,-5.68; P$6 -1.25,-5.68; P$7 -0.75,-5.68; P$8 -0.25,-5.68; P$9 0.25,-5.68; P$10 0.75,-5.68; P$11 1.25,-5.68; P$12 1.75,-5.68; P$13 2.25,-5.68; P$14 2.75,-5.68; P$15 3.25,-5.68; P$16 3.75,-5.68; P$33 3.75,5.68; P$34 3.25,5.68; P$35 2.75,5.68; P$36 2.25,5.68; P$37 1.75,5.68; P$38 1.25,5.68; P$39 0.75,5.68; P$40 0.25,5.68; P$41 -0.25,5.68; P$42 -0.75,5.68; P$43 -1.25,5.68; P$44 -1.75,5.68; P$45 -2.25,5.68; P$46 -2.75,5.68; P$47 -3.25,5.68; P$48 -3.75,5.68 | smd 1.6 x 0.28: P$17 5.68,-3.75; P$18 5.68,-3.25; P$19 5.68,-2.75; P$20 5.68,-2.25; P$21 5.68,-1.75; P$22 5.68,-1.25; P$23 5.68,-0.75; P$24 5.68,-0.25; P$25 5.68,0.25; P$26 5.68,0.75; P$27 5.68,1.25; P$28 5.68,1.75; P$29 5.68,2.25; P$30 5.68,2.75; P$31 5.68,3.25; P$32 5.68,3.75; P$49 -5.68,3.75; P$50 -5.68,3.25; P$51 -5.68,2.75; P$52 -5.68,2.25; P$53 -5.68,1.75; P$54 -5.68,1.25; P$55 -5.68,0.75; P$56 -5.68,0.25; P$57 -5.68,-0.25; P$58 -5.68,-0.75; P$59 -5.68,-1.25; P$60 -5.68,-1.75; P$61 -5.68,-2.25; P$62 -5.68,-2.75; P$63 -5.68,-3.25; P$64 -5.68,-3.75 | smd 5.31 x 5.31: P$65 0,0 | drill 0.3 pad 0.6: P$66 -1.27,1.27; P$67 0,1.27; P$68 1.27,1.27; P$69 -1.27,0; P$70 0,0; P$71 1.27,0; P$72 -1.27,-1.27; P$73 0,-1.27; P$74 1.27,-1.27
P-PWSON-N6 = smd 0.3 x 0.7: P$1 -0.65,-1.05; P$2 0,-1.05; P$3 0.65,-1.05; P$4 0.65,1.05; P$5 0,1.05; P$6 -0.65,1.05 | drill 0.33 pad 0.5: P$8 -0.4,0; P$9 0.4,0 | smd 1.6 x 1: P$EP 0,0
PSOP-8-POWERPAD-DDA = smd 0.6 x 1.6: 1 -1.905,-2.7; 2 -0.635,-2.7; 3 0.635,-2.7; 4 1.905,-2.7; 5 1.905,2.7; 6 0.635,2.7; 7 -0.635,2.7; 8 -1.905,2.7 | smd 4.95 x 2: EP 0,0 | drill 0.33: P$1 0,0.508; P$2 -1.27,0.508; P$3 -1.27,-0.508; P$4 0,-0.508; P$5 1.27,-0.508; P$6 1.27,0.508
R-PDSO-G6 = smd 0.6 x 1.1: 1 -0.95,-1.35; 2 0,-1.35; 3 0.95,-1.35; 4 0.95,1.35; 5 0,1.35; 6 -0.95,1.35
R-PDSO-G8 = smd 0.3 x 0.8: 1 -0.75,-1.55; 2 -0.25,-1.55; 3 0.25,-1.55; 4 0.75,-1.55; 5 0.75,1.55; 6 0.25,1.55; 7 -0.25,1.55; 8 -0.75,1.55
KC2520C = smd 1.27 x 0.635: P$1 -0.925,-0.725; P$2 0.925,-0.725; P$3 0.925,0.725; P$4 -0.925,0.725

### Placement (x,y rotation side)
C1  15.11,25.53 90 top
C2  46.74,11.43 90 top
C3  45.09,14.1 0 top
C4  55.24,12.95 270 top
C5  55.24,17.4 270 top
C6  49.66,10.29 180 top
C7  38.35,21.59 0 top
C8  20.19,26.16 90 top
C9  41.66,17.91 270 top
C10  32.89,15.75 270 top
C11  46.48,19.94 0 top
C12  25.65,15.24 270 top
C13  27.56,33.27 90 top
C14  29.46,15.75 270 top
C15  30.99,33.27 90 top
C16  20.83,22.99 180 top
C17  20.83,27.81 180 top
C18  38.35,26.16 0 top
C19  38.35,27.3 0 top
C20  30.61,15.75 270 top
C21  28.7,33.27 90 top
C22  20.83,24.51 180 top
C23  29.84,33.27 90 top
C24  54.86,22.35 180 top
C28  32.13,33.27 90 top
C30  38.35,22.73 0 top
D1  51.18,44.96 0 top
D2  51.18,43.18 0 top
D3  51.18,41.4 0 top
D4  51.18,39.62 0 top
D5  51.18,37.85 0 top
J1  62.48,25.4 90 top
J2  22.48,3.43 180 top
J3  45.59,3.43 180 top
J4  37.21,48.9 0 top
J5  20.45,48.77 0 top
J6  6.35,33.4 90 top
J7  11.56,17.4 0 top
R1  38.35,23.88 180 top
R2  27.43,10.79 180 top
R3  27.43,12.06 180 top
R4  40.77,10.79 90 top
R5  41.66,15.75 270 top
R6  21.34,26.16 90 top
R7  31.75,15.75 270 top
R8  54.23,44.96 180 top
R9  54.23,43.18 180 top
R10  54.23,41.4 180 top
R11  54.23,39.62 180 top
R12  54.23,37.85 180 top
R13  34.67,44.07 0 top
R14  37.21,44.07 180 top
TP1  12.45,42.42 180 top
TP2  12.45,40.39 0 top
TP3  21.08,42.42 180 top
TP4  19.18,40.39 0 top
TP6  17.65,22.35 0 top
TP7  19.18,42.42 0 top
TP8  10.54,40.39 0 top
TP10  10.54,42.42 0 top
TP11  21.08,40.39 90 top
TP12  15.88,22.35 0 top
U1  54.99,25.15 90 top
U2  29.59,24.51 0 top
U3  43.43,11.43 270 top
U4  51.05,15.11 0 top
U5  44.96,17.14 90 top
U6  52.83,35.43 90 top
X1  17.4,25.53 270 top

### Tracks (layer width: path | path; a pad name or v marks a point on that pad's centre or on a via)
3V3_PG
  Top 0.152: U4.8 48.29,17.81 48.01,17.53 48.01,9.4 47.37,8.76 41.4,8.76 40.77,9.4 R4.1 41.3,10.31 41.77,10.78 U3.P$3
!RESET  (via drill 0.25)
  Top 0.152: U5.1 45.66,16.2 45.21,15.75 44.7,15.75 44.26,16.2 U5.6 41.69,16.2 R5.1 41.56,16.13 v40.51,16.13 | U2.P$57 v25.65,24.26 | J2.15 16.13,11.3 19.43,14.61 23.37,14.61 23.75,14.99 23.75,18.67 25.65,20.57 v25.65,24.26
  Top 0.229: v25.65,24.26
  Bottom 0.152: v25.65,24.26 25.65,22.48 25.15,21.97 25.15,18.03 27.05,16.13 v40.51,16.13
+1V0  (via drill 0.25, 0.51)
  Top 0.152: TP3.P$1 v22.1,41.4
  Top 0.229: 52.32,17.78 51.72,17.78 U4.6 | C14.1 29.46,16.89 29.84,17.27 U2.P$9 29.84,19.81 v30.1,20.07 30.34,19.82 U2.P$10 30.34,17.28 30.61,17.02 C20.1 | v34.04,22.23 34.07,22.26 U2.P$20 36.67,22.26 37.34,21.59 C7.1 | v34.04,25.78 34.06,25.76 U2.P$27 36.68,25.76 37.08,26.16 C18.1 | v34.04,27.81 34.09,27.76 U2.P$31 36.5,27.76 36.96,27.3 C19.1 | v25.15,24.77 v25.14,24.76 U2.P$56 22.35,24.77 22.1,24.51 C22.1 | v29.84,28.57 v29.84,28.58 U2.P$40 C23.1 | U2.P$52 22.9,26.76 21.84,27.81 C17.1 21.34,27.79 R6.2 | U2.P$59 22.12,23.26 21.84,22.99 C16.1 | C21.1 28.7,32 29.34,31.37 U2.P$41 | C15.1 30.99,32 30.35,31.37 30.35,30.2 U2.P$39 | U5.3 46.54,18.09 46.99,18.54 46.99,19.91 C11.2 46.96,21.05 v46.99,21.08
  Top 0.254: U2.P$39 v30.34,28.97 v30.35,28.96 | U2.P$41 v29.34,28.96 | U2.P$52 25.11,26.76 v25.15,26.8 | U2.P$59 25.13,23.26 v25.15,23.24
  Top 0.406: 55.12,18.07 C5.1 55.21,18.16 54.1,18.16 53.75,17.81 U4.5
  Top 0.508: U4.5 52.36,17.81 52.32,17.78 52.32,19.81 51.05,21.08 v46.99,21.08 43.56,21.08 42.29,19.81 v35.81,19.81
  Bottom 0.152: v29.34,28.96 29.34,40.77 28.7,41.4 v22.1,41.4
  pour Route15 (rank 4): 25.78,31.62 22.61,28.45 22.61,20.57 25.65,17.53 34.8,17.53 36.58,19.3 36.58,25.4 38.99,27.81 38.99,30.23 37.59,31.62
  pour Top (no thermals): 51.44,17.02 51.44,18.54 52.2,19.3 52.45,19.3 53.21,18.54 53.21,17.02
+3V3  (via drill 0.25, 0.28, 0.38, 0.38 pad 0.76)
  Top 0.152: TP2.P$1 v12.45,36.7 | D2.1 v42.04,43.18 | R13.2 v35.94,44.07 R14.2 | R7.2 31.78,15.27 32.13,15.62 32.26,15.62 32.87,16.23 C10.1
  Top 0.229: C30.1 37.34,22.73 36.81,23.26 U2.P$22 34.18,23.26 v34.04,23.24 | C28.1 32.13,32 32.84,31.29 U2.P$34 32.84,29.16 v32.64,28.96 | C13.1 27.56,31.88 27.84,31.59 U2.P$44 27.84,28.98 27.56,28.7 v26.8,28.7 | v18.12,28.16 X1.P$4 X1.P$1 15.56,26.45 C1.2 | U2.P$55 25.64,25.26 v26.04,25.65 | U2.P$3 26.84,20.24 v27.3,20.7 | U2.P$13 31.84,20.36 v31.5,20.7 | R4.2 v40.77,12.06 40.77,12.08 | R5.2 35.08,15.27 v35.05,15.24 | U6.8 40.91,34.68 v40.89,34.67 40.89,42.04 v42.04,43.18
  Top 0.254: U2.P$3 26.84,17.7 25.65,16.51 C12.1
  Top 0.279: U2.P$13 31.84,17.82 32.89,16.76 C10.1
  Top 0.406: U3.P$1 40.77,12.08 37.32,12.08 35.05,14.35 v35.05,15.24 35.05,19.18 33.66,20.57 v33.66,20.95 | C3.1 41.53,14.1 40.77,13.34 v40.77,12.06 | v40.89,34.67 40.89,31.75 38.48,29.34 v35.69,29.34
  Bottom 0.152: v35.94,44.07 41.15,44.07 v42.04,43.18
  Bottom 0.229: v18.12,28.16 18.12,27.72 18.54,27.3 24.38,27.3 v25.65,28.57
  Bottom 0.406: v25.65,28.57 17.53,36.7 v12.45,36.7 11.18,36.7 9.4,38.48 J6.5 4.83,38.48 3.68,37.34 3.68,29.46 4.83,28.32 J6.1
  pour Route15: 27.18,20.95 27.05,20.83 27.05,20.57 27.18,20.45 27.56,20.45 27.69,20.57 31.11,20.57 31.5,20.19 32.38,20.19 32.77,20.57 34.04,20.57 34.04,21.46 33.66,21.84 33.4,21.84 33.15,22.1 33.15,22.61 33.53,22.99 34.29,22.99 34.29,23.5 33.53,23.5 33.15,24 33.15,28.32 33.27,28.32 33.78,28.83 35.94,28.83 35.94,29.59 32.64,29.59 31.11,28.07 28.83,28.07 27.94,28.96 27.18,28.96 27.05,29.08 26.54,29.08 26.42,28.96 25.65,28.96 25.4,28.7 25.4,28.32 25.91,27.81 25.91,26.04 25.78,25.91 25.78,25.53 25.91,25.4 26.16,25.4 26.29,25.53 26.29,25.91 26.16,26.04 26.16,28.07 26.54,28.45 27.94,28.45 28.7,27.69 32.38,27.69 32.77,27.3 32.77,23.75 32.51,23.5 32.51,21.46 32.26,21.21 31.5,21.21 31.11,20.83 27.69,20.83 27.56,20.95
+5V  (via drill 0.25, 0.33, 0.38)
  Top 0.152: TP1.P$1 v13.46,41.4 | D1.1 v49.4,44.96
  Top 0.229: C9.2 41.68,17.4 42.42,17.4 42.67,17.14 U5.5 U5.4 | U2.P$23 36.95,23.76 v36.96,23.75
  Top 0.305: U3.P$4 45.58,10.78 v45.59,10.79 | U3.P$6 45.58,12.08 v45.59,12.06 | U5.5 44.58,17.14 44.96,17.53 v44.96,18.03 44.9,18.09 | J1.P$1 58.31,24.15 56.91,24.15 v56.9,24.13 56.88,24.15 U1.P$1 U1.P$10
  Top 0.406: U4.4 54.99,12.41 C4.2 | v45.59,12.06 46.57,12.06 C2.2 | v56.9,24.13 v56.9,22.35 C24.1
  Top 0.559: U4.4 v52.96,10.54
  pour Route15 (rank 6): 62.87,49.15 62.87,2.54 arc-90 60.33,0 2.54,0 arc-90 0,2.54 0,49.15 arc-90 2.54,51.69 60.33,51.69 arc-90
AGND  (via drill 0.25, 0.28, 0.38, 4.45 pad 6.35)
  Top 0.152: R8.1 v55.5,44.96 | R9.1 v55.5,43.18 | R10.1 v55.5,41.4 | R11.1 v55.5,39.62 | R12.1 v55.5,37.85 | TP12.P$1 v14.73,23.5
  Top 0.229: C14.2 v29.46,14.48 | C20.2 v30.61,14.48 | C10.2 v32.89,14.48 | R1.1 v39.62,23.88 | C19.2 v39.62,27.3 | C18.2 v39.62,26.16 | C30.2 v39.62,22.73 | C7.2 v39.62,21.59 | U2.P$54 25.13,25.76 v25.15,25.78 | C8.2 19.46,26.64 v19.43,26.67 | C22.2 v19.56,24.51 | C16.2 v19.56,22.99 | C13.2 v27.56,34.54 | C21.2 v28.7,34.54 | C23.2 v29.84,34.54 | C15.2 v30.99,34.54 | C28.2 v32.13,34.54 | C17.2 v19.56,27.81 | C12.2 v25.65,13.59 | C1.1 15.56,24.6 X1.P$2 17.36,24.6 v17.4,24.64 | 43.83,11.43 U3.P$EP | U4.P$4 U4.EP | C9.1 v41.66,19.18 | TP8.P$1 v9.27,40.39 | TP10.P$1 v9.27,42.42 | TP7.P$1 v17.91,42.42 | TP4.P$1 v17.91,40.39 | U6.4 55.23,36.18 v55.63,36.58
  Top 0.254: C11.1 v45.21,19.94
  Top 0.279: U1.P$8 v53.98,25.15 | U1.P$3 v56.01,25.15
  Top 0.305: U5.2 45.34,17.14 44.96,16.76 v44.96,16.26 | C6.1 v50.93,10.29 | U3.P$5 43.83,11.43 U3.P$8
  Top 0.406: C24.2 v52.83,22.35 | C4.1 v55.24,15.11 C5.2 | U4.3 51.69,13.08 51.18,13.59 51.18,14.48 U4.P$4 | C3.2 v47.12,14.1 | C2.1 v46.74,9.4 | J1.P$5 57.05,26.7 v57.02,26.67
  other vias: 8.76,18.92 9.27,19.3 9.27,18.54 9.27,17.78 8.76,18.16 8.76,17.4 9.27,17.02 8.76,16.64 9.27,16.26 8.76,15.88 9.27,15.49 5.08,46.61 57.78,5.08
  pour Route2: 62.87,49.15 62.87,2.54 arc-90 60.33,0 2.54,0 arc-90 0,2.54 0,49.15 arc-90 2.54,51.69 60.33,51.69 arc-90
  pour Top: 8.51,19.18 8.51,15.62 9.27,14.86 13.08,14.86 14.86,16.64 19.81,16.64 24,20.83 21.97,20.83 19.43,18.29 14.73,18.29 13.08,19.94 9.27,19.94
AUDIO_ENABLE  (via drill 0.25)
  Top 0.152: U2.P$19 36.41,21.76 v36.7,21.46 | v38.99,28.32 38.61,28.7 35.43,28.7 35.18,28.96 35.18,31.11 36.45,32.38 v36.45,33.15
  Bottom 0.152: v36.7,21.46 37.47,22.23 37.47,26.8 v38.99,28.32 | 25.91,48.01 32.38,41.53 34.92,41.53 36.07,40.39 36.07,33.53 v36.45,33.15
  Bottom 0.229: 25.91,48.01 25.91,48.39 J5.6
AUDIO_STREAMING  (via drill 0.25, 0.28)
  Top 0.152: U2.P$17 40.19,20.76 v40.26,20.83
  Top 0.229: U6.3 v53.47,35.68 v53.47,35.69
  Bottom 0.152: v40.26,20.83 42.16,22.73 42.16,31.62 43.94,33.4 48.51,33.4 50.8,35.69 v53.47,35.69
CLK
  Top 0.152: U2.P$58 18.66,23.76 18.29,24.13 | 18.29,24.13 18.29,24.44 | TP6.P$1 17.65,23.75 18.03,24.13 18.29,24.13
  Top 0.229: 18.17,24.4 18.17,24.55 X1.P$3 18.29,24.44
I2C_SCL
  Top 0.152: U2.P$14 32.34,20.28 32.64,20.57 32.64,28.19 34.04,29.59 34.04,32.51 35.69,34.16 35.69,40.26 33.4,42.55 33.4,44.07 | J4.1 33.4,44.07 | R13.1 33.4,44.07
I2C_SDA
  Top 0.152: J4.3 38.48,44.07 | 38.48,44.07 38.48,42.67 36.07,40.26 36.07,34.04 34.42,32.38 34.42,29.46 33.02,28.07 33.02,20.57 33.34,20.25 U2.P$16 | R14.1 38.48,44.07
I2S_BCLK
  Top 0.152: J3.3 43.05,7.24 25.78,7.24 24.77,8.26 24.77,16.26 26.34,17.83 U2.P$2
I2S_DATA
  Top 0.152: J3.1 45.09,7.75 26.04,7.75 25.27,8.51 25.27,11.94 26.54,13.21 26.54,16.76 27.34,17.56 U2.P$4
I2S_LRCLK
  Top 0.152: J3.5 41.02,6.73 25.53,6.73 24.26,8 24.26,16.26 25.84,17.84 U2.P$1
I2S_MCLK
  Top 0.152: U2.P$64 22.92,20.76 19.6,17.44 13.12,17.44
  Top 0.229: J7.P$3 13.12,17.44
LINE_OUT_SEL  (via drill 0.25, 0.28)
  Top 0.152: U2.P$18 34.24,21.26 33.4,22.1 33.4,27.94 34.8,29.34 34.8,31.5 v35.69,32.38 | U6.6 v49.53,35.68
  Top 0.229: v49.53,35.68 v49.53,35.69
  Bottom 0.152: v49.53,35.69 43.31,35.69 40.01,32.38 v35.69,32.38 35.69,40.13 34.67,41.15 32.13,41.15 27.18,46.1 25.27,46.1 23.37,48.01
  Bottom 0.229: 23.37,48.01 23.37,48.39 J5.5
LINK_DOWN0  (via drill 0.25)
  Top 0.152: v22.86,14.1 19.68,14.1 17.4,11.81 17.4,3.43 J2.14 | U2.P$6 28.34,17.55 27.81,17.02 27.81,14.86 v27.05,14.1
  Bottom 0.152: v27.05,14.1 v22.86,14.1
LINK_DOWN1  (via drill 0.25)
  Top 0.152: v22.86,15.11 19.18,15.11 12.32,8.26 12.32,3.43 J2.18 | U2.P$5 27.84,17.55 27.43,17.14 27.43,15.49 v27.05,15.11
  Bottom 0.152: v27.05,15.11 v22.86,15.11
  Bottom 0.229: v27.05,15.11 27.05,14.99
LINK_UP0  (via drill 0.25)
  Top 0.152: v26.16,12.06 R3.2
  Bottom 0.152: v26.16,12.06 25.65,12.06 25.27,11.68 25.27,5.59 | 25.02,3.43 J2.10
  Bottom 0.229: 25.27,5.59 25.02,5.33 25.02,3.43
LINK_UP1  (via drill 0.25)
  Top 0.152: R2.2 v26.16,10.79
  Bottom 0.152: v26.16,10.79 26.8,10.79 | 27.3,10.29 27.3,5.59 | 27.56,3.43 J2.6
  Bottom 0.229: 26.8,10.79 27.3,10.29 | 27.3,5.59 27.56,5.33 27.56,3.43
MCLK_SEL  (via drill 0.25)
  Top 0.152: U2.P$42 28.84,28.97 v27.56,27.69
  Bottom 0.152: v27.56,27.69 27.56,25.91 26.67,25.02 25.78,25.02 25.53,25.27 18.41,25.27 10.29,33.4 J6.3
N$1
  Top 0.229: U2.P$24 37.46,24.26 37.85,23.88 R1.2
N$2  (via drill 0.25)
  Top 0.152: U2.P$60 22.38,22.76 21.84,22.23 v19.43,22.23 | v19.05,9.4 19.05,7.62 19.68,6.99 23.75,6.99 26.04,4.7
  Top 0.229: J2.7 26.04,4.7
  Bottom 0.152: v19.43,22.23 19.43,9.78 v19.05,9.4
N$3  (via drill 0.25)
  Top 0.152: U2.P$61 22.52,22.26 21.97,21.72 v19.94,21.72 | v18.29,8.51 18.29,7.11 19.05,6.35 22.1,6.35 J2.9
  Bottom 0.152: v19.94,21.72 19.94,9.14 19.3,8.51 v18.29,8.51
N$4  (via drill 0.25)
  Top 0.152: U2.P$62 22.65,21.76 22.1,21.21 v20.45,21.21 | v20.19,8.51 22.99,8.51 25.27,6.22 27.3,6.22 J2.5
  Bottom 0.152: v20.45,21.21 20.45,8.76
  Bottom 0.229: 20.45,8.76 v20.19,8.51
N$5  (via drill 0.25)
  Top 0.152: U2.P$63 22.79,21.26 22.23,20.7 v20.95,20.7
  Bottom 0.152: v20.95,20.7 20.95,8.13 18.67,5.84 J2.13
N$6
  Top 0.152: U6.5 49.8,36.18 49.15,36.83 49.15,38.99 49.78,39.62
  Top 0.229: 49.78,39.62 D4.1
N$7
  Top 0.152: D1.2 R8.2
N$8
  Top 0.152: U2.P$7 28.84,17.54 28.19,16.89 28.19,12.95 27.91,12.67 R3.1
  Top 0.229: 28.83,18.82 U2.P$7 | R3.1 27.94,12.06
N$9
  Top 0.152: U2.P$8 29.34,17.53 28.57,16.76 28.57,11.43 27.94,10.79 R2.1
  Top 0.229: U2.P$8
N$10
  Top 0.152: U2.P$11 30.84,17.67 31.75,16.76 R7.1
N$11
  Top 0.229: C6.2 49.18,12.38 U4.1
N$12
  Top 0.152: D2.2 R9.2
N$13
  Top 0.152: D3.1 49.4,41.4 48.64,40.64 48.64,35.69 49.15,35.18 U6.7
  Top 0.229: U6.7
N$14
  Top 0.152: D3.2 R10.2
N$15
  Top 0.152: D4.2 R11.2
N$16
  Top 0.152: D5.1 50.38,37.12 50.67,36.83 51.94,36.83 52.58,36.2 52.58,35.69 53.09,35.18 U6.2
  Top 0.229: U6.2
N$17
  Top 0.152: D5.2 R12.2
PLL_AVDD  (via drill 0.25)
  Top 0.152: U2.P$53 25.63,26.26 25.91,26.54 25.91,27.05 25.15,27.81 v25.15,31.24 | v21.08,38.86 TP11.P$1
  Top 0.229: C8.1 R6.1 22.25,25.68 22.83,26.26 U2.P$53
  Bottom 0.152: v25.15,31.24 25.15,37.97 24.26,38.86 v21.08,38.86
USB_CONNECTED  (via drill 0.25, 0.28)
  Top 0.152: v43.18,33.4 53.72,33.4 54.36,34.04 54.36,34.66 | U2.P$15 v32.84,20.01
  Top 0.229: 54.36,34.66 U6.1
  Bottom 0.152: v43.18,33.4 35.31,25.53 35.31,21.34 34.29,20.32 34.04,20.07 33.98,20.01 v32.84,20.01
USB_D_N  (via drill 0.25)
  Top 0.279: J1.P$2 58.34,24.77 56.39,24.77 56.27,24.65 U1.P$2 U1.P$9 | v51.56,25.35 51.56,25.26 37.03,25.26 U2.P$26 | 54.6,24.64 U1.P$9 | U1.P$9 53.73,24.65 53.47,24.91 53.21,24.91 52.96,24.65 v52.96,24.13
  Bottom 0.279: 51.56,25.26 v51.56,25.35 52.25,25.35 52.96,24.64 v52.96,24.13
USB_D_P  (via drill 0.25)
  Top 0.279: J1.P$3 56.52,25.4 56.27,25.65 U1.P$4 U1.P$7 53.73,25.65 53.47,25.39 52.86,25.39 52.25,24.78 52.25,24.18 v52.2,24.13 | v51.56,24.69 51.56,24.78 35.29,24.78 U2.P$25
  Bottom 0.279: 51.56,24.78 v51.56,24.69 52.02,24.69 52.2,24.51 v52.2,24.13
VOLUME_A
  Top 0.152: U2.P$47 26.34,31.44 25.91,31.88 19.68,31.88 16.26,35.31 16.26,45.47 17.27,46.48 19.05,46.48 20.45,47.88 J5.4
VOLUME_B
  Top 0.152: U2.P$49 22.67,28.26 15.62,35.31 15.62,45.72 17.91,48.01 J5.3
VOLUME_C
  Top 0.152: U2.P$50 22.53,27.76 14.99,35.31 14.99,48.39 J5.2

### Text on the board
tNames: +5V | +3V3 | +5V | +5V | +1V0 | USB_CONNECT | +3V3 | PLL_AVDD | AUDIO_STREAM | LINE_OUT_SEL | CLK | SmartStand USB DAC/I2S / revision B